# Altium project Buck.PrjPcb
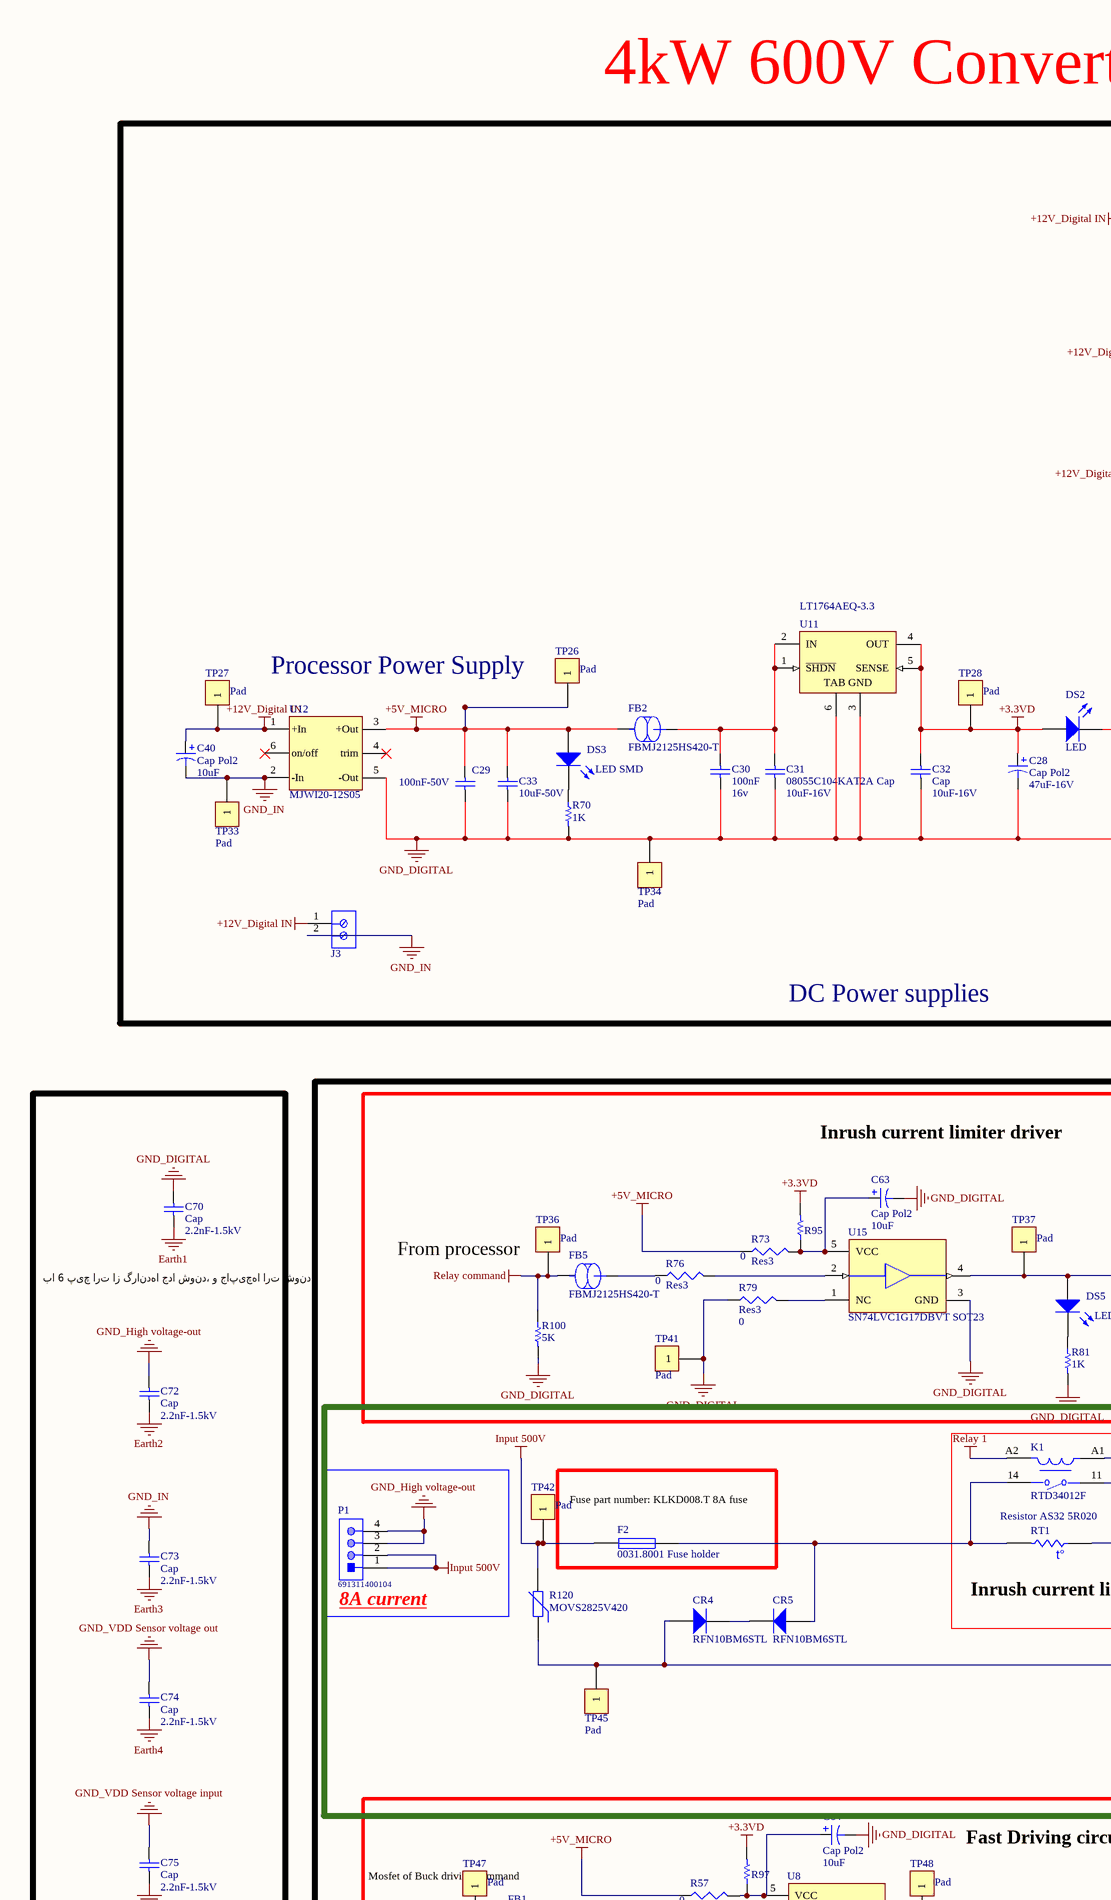
[diagram p0: Buck-15.SchDoc, top left]
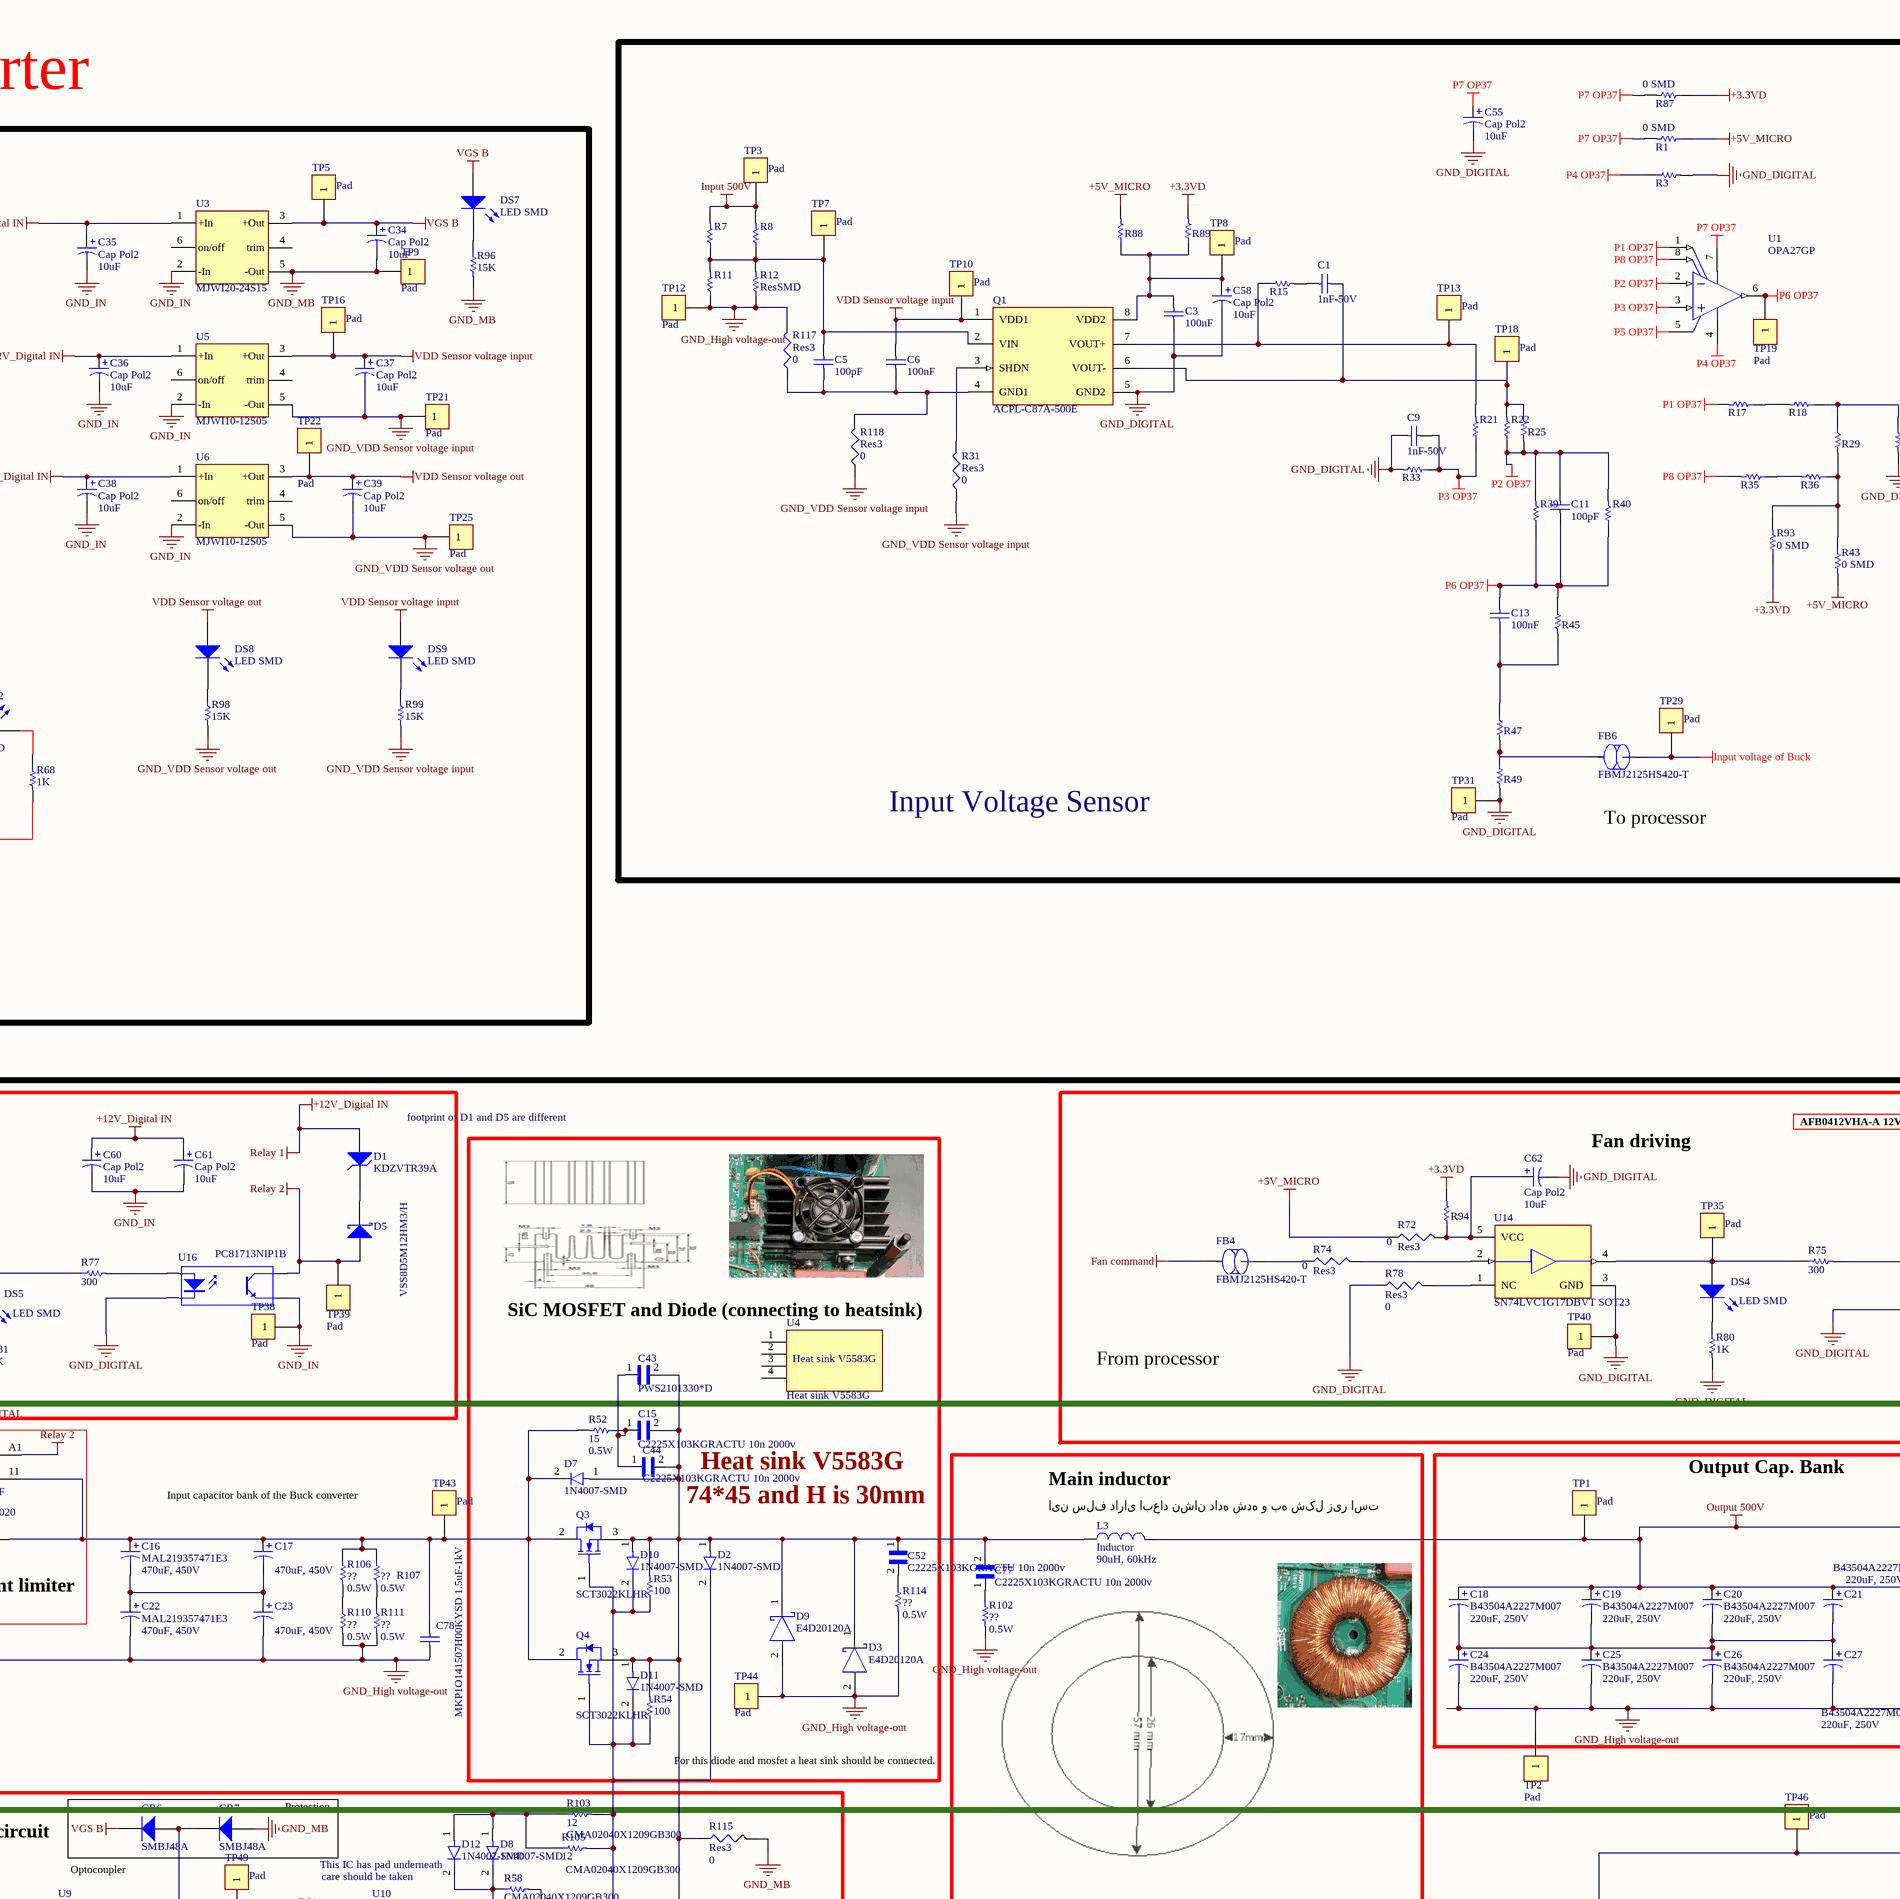
[diagram p1: Buck-15.SchDoc, top middle]
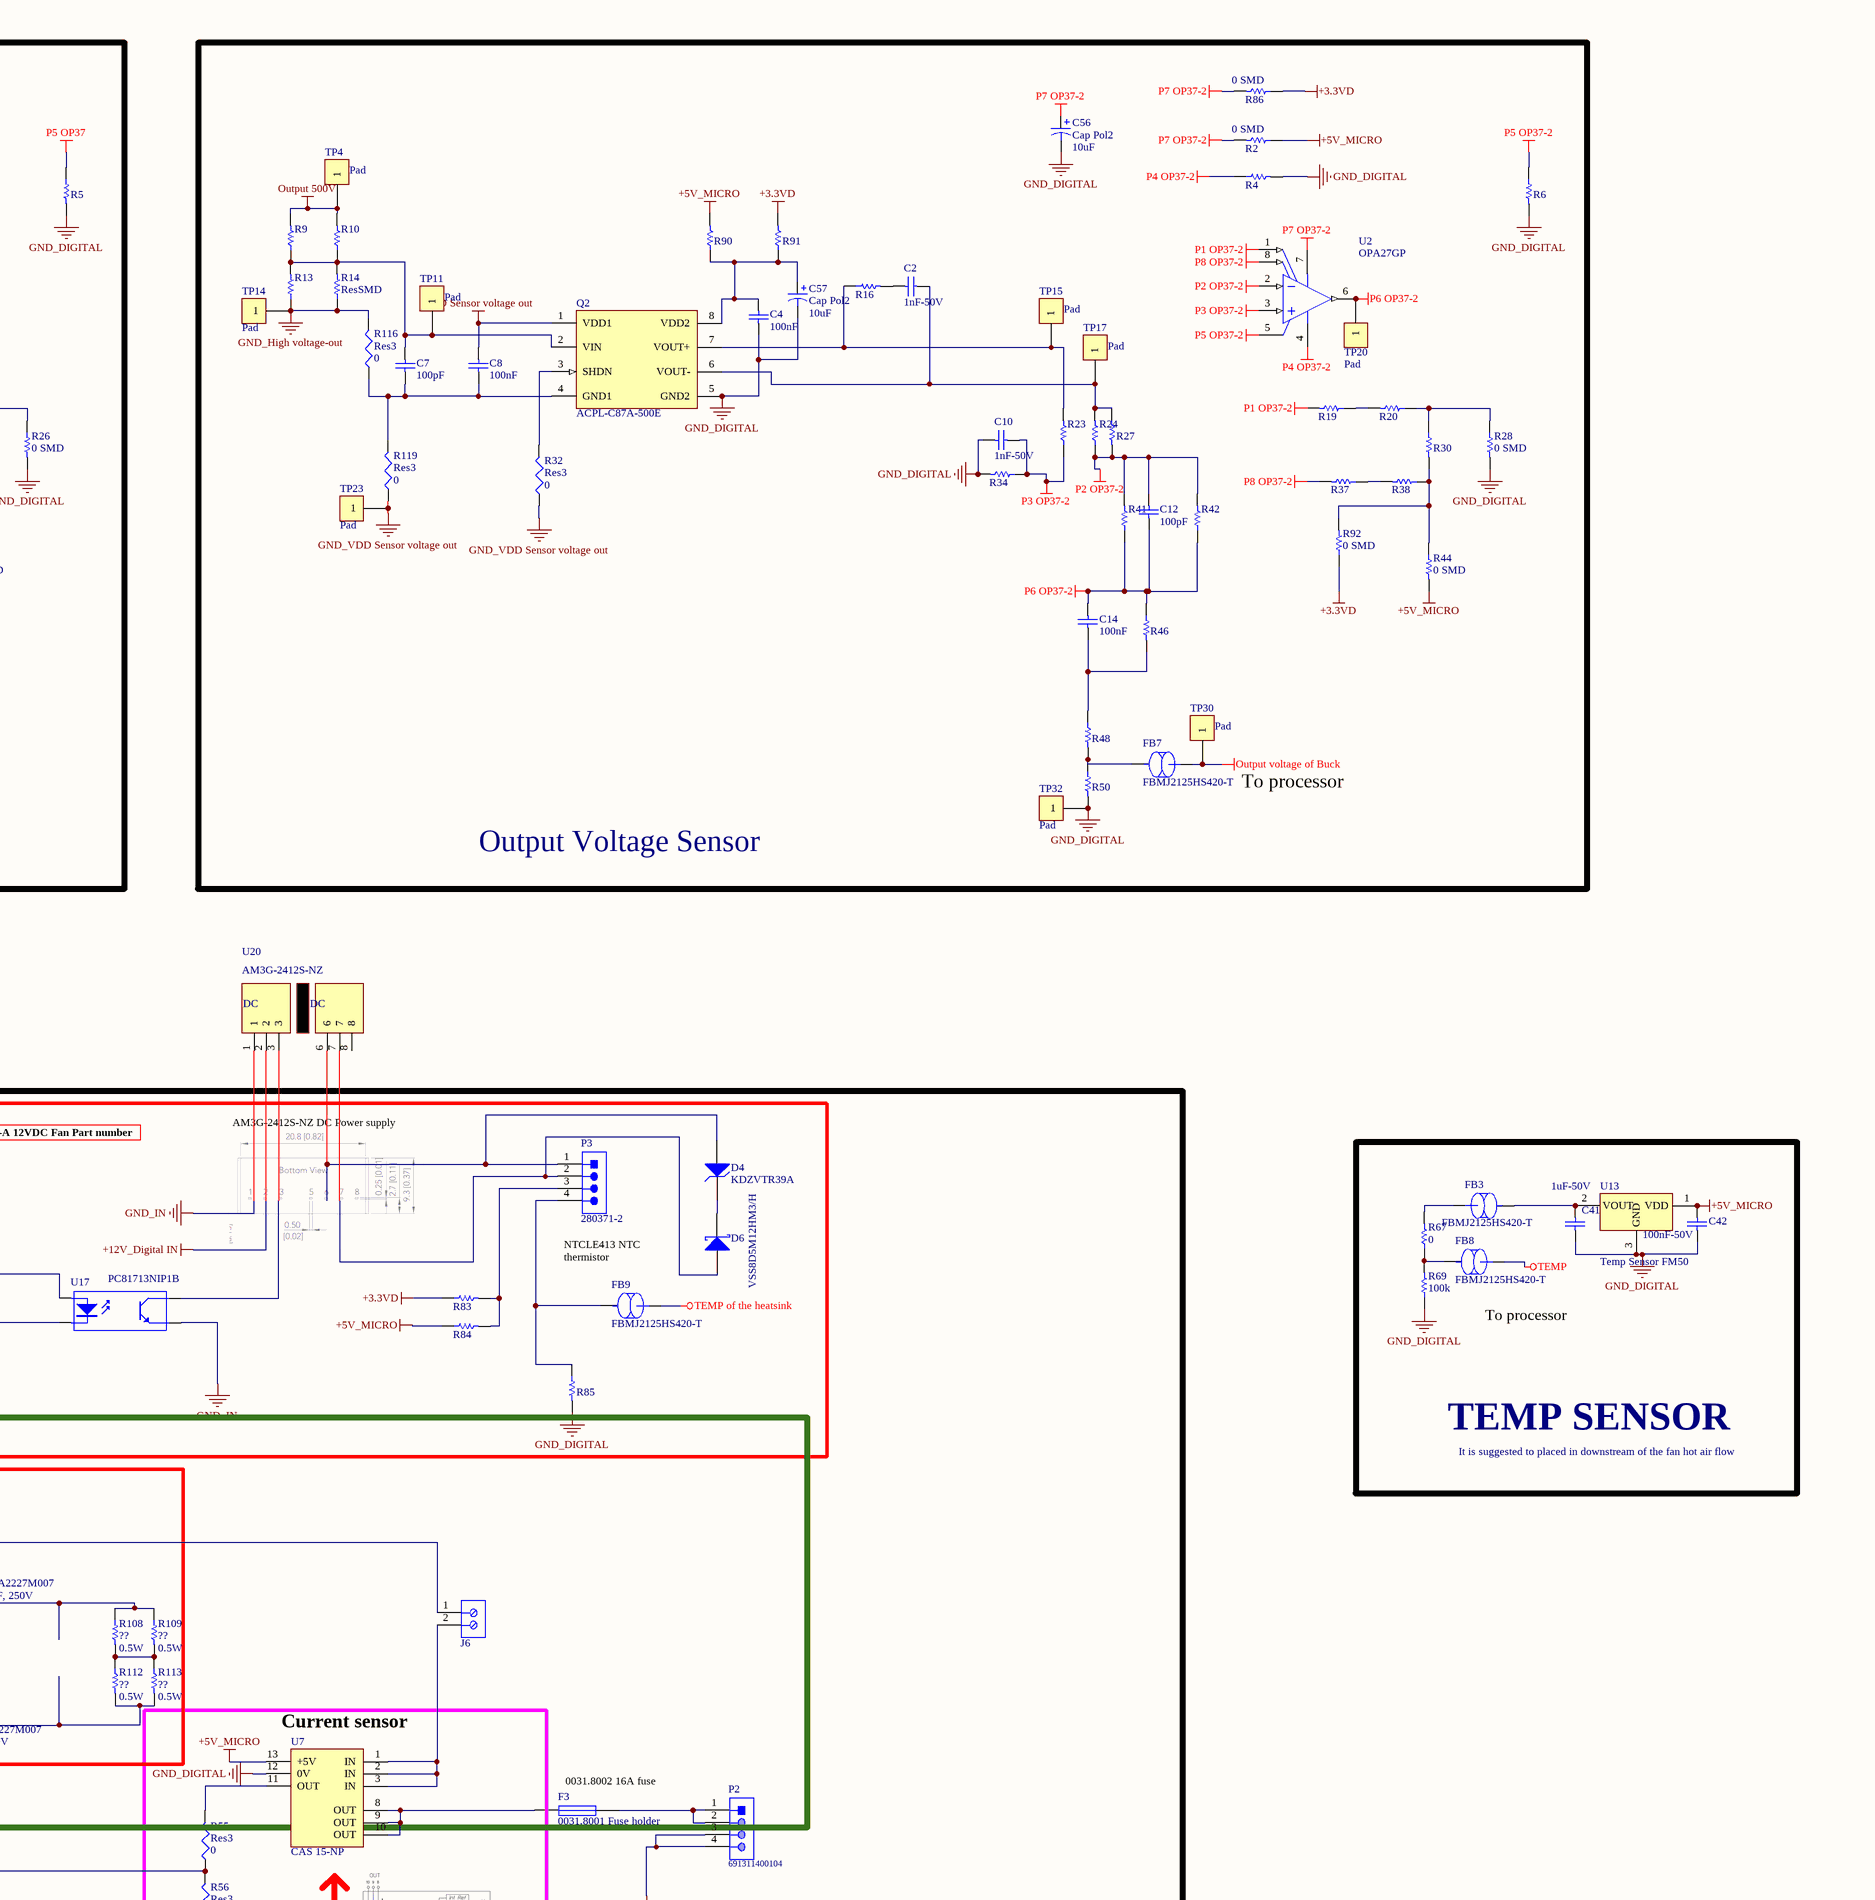
[diagram p2: Buck-15.SchDoc, top right]
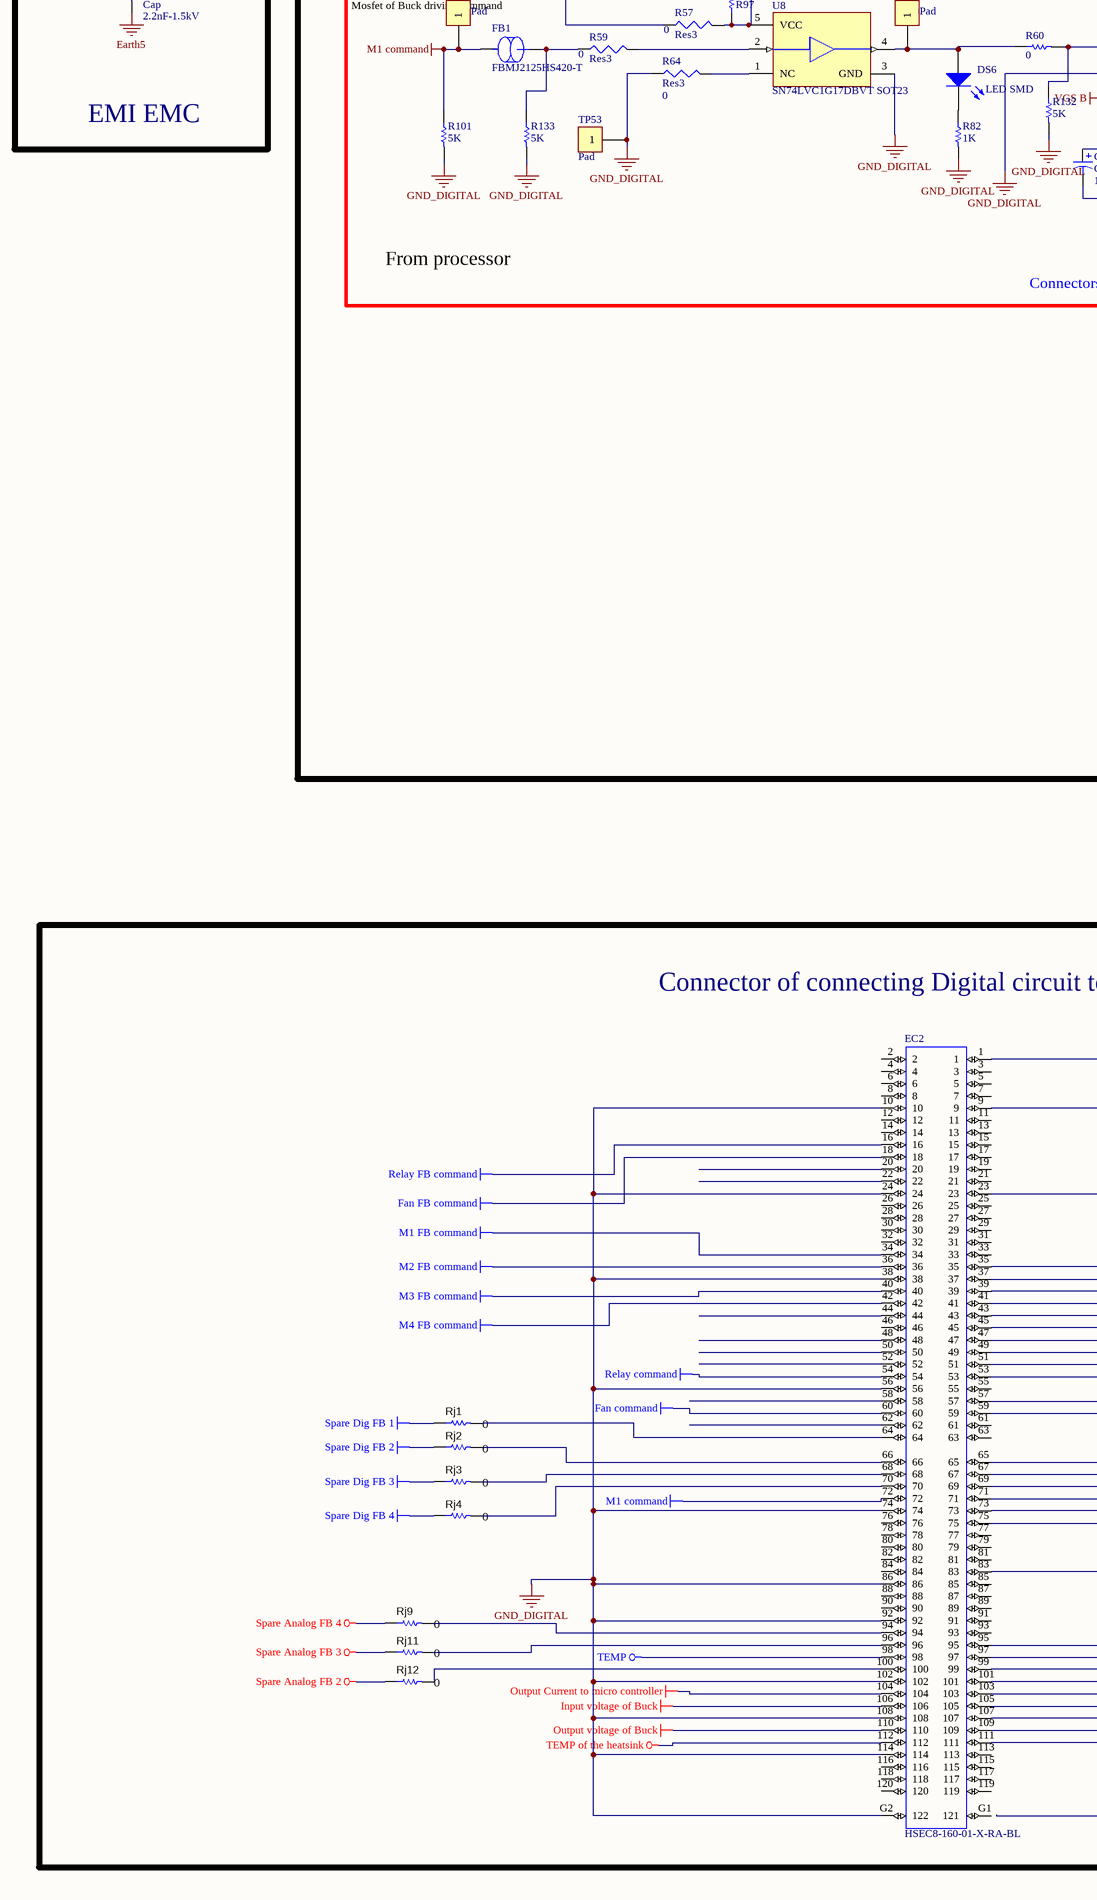
[diagram p3: Buck-15.SchDoc, bottom left]
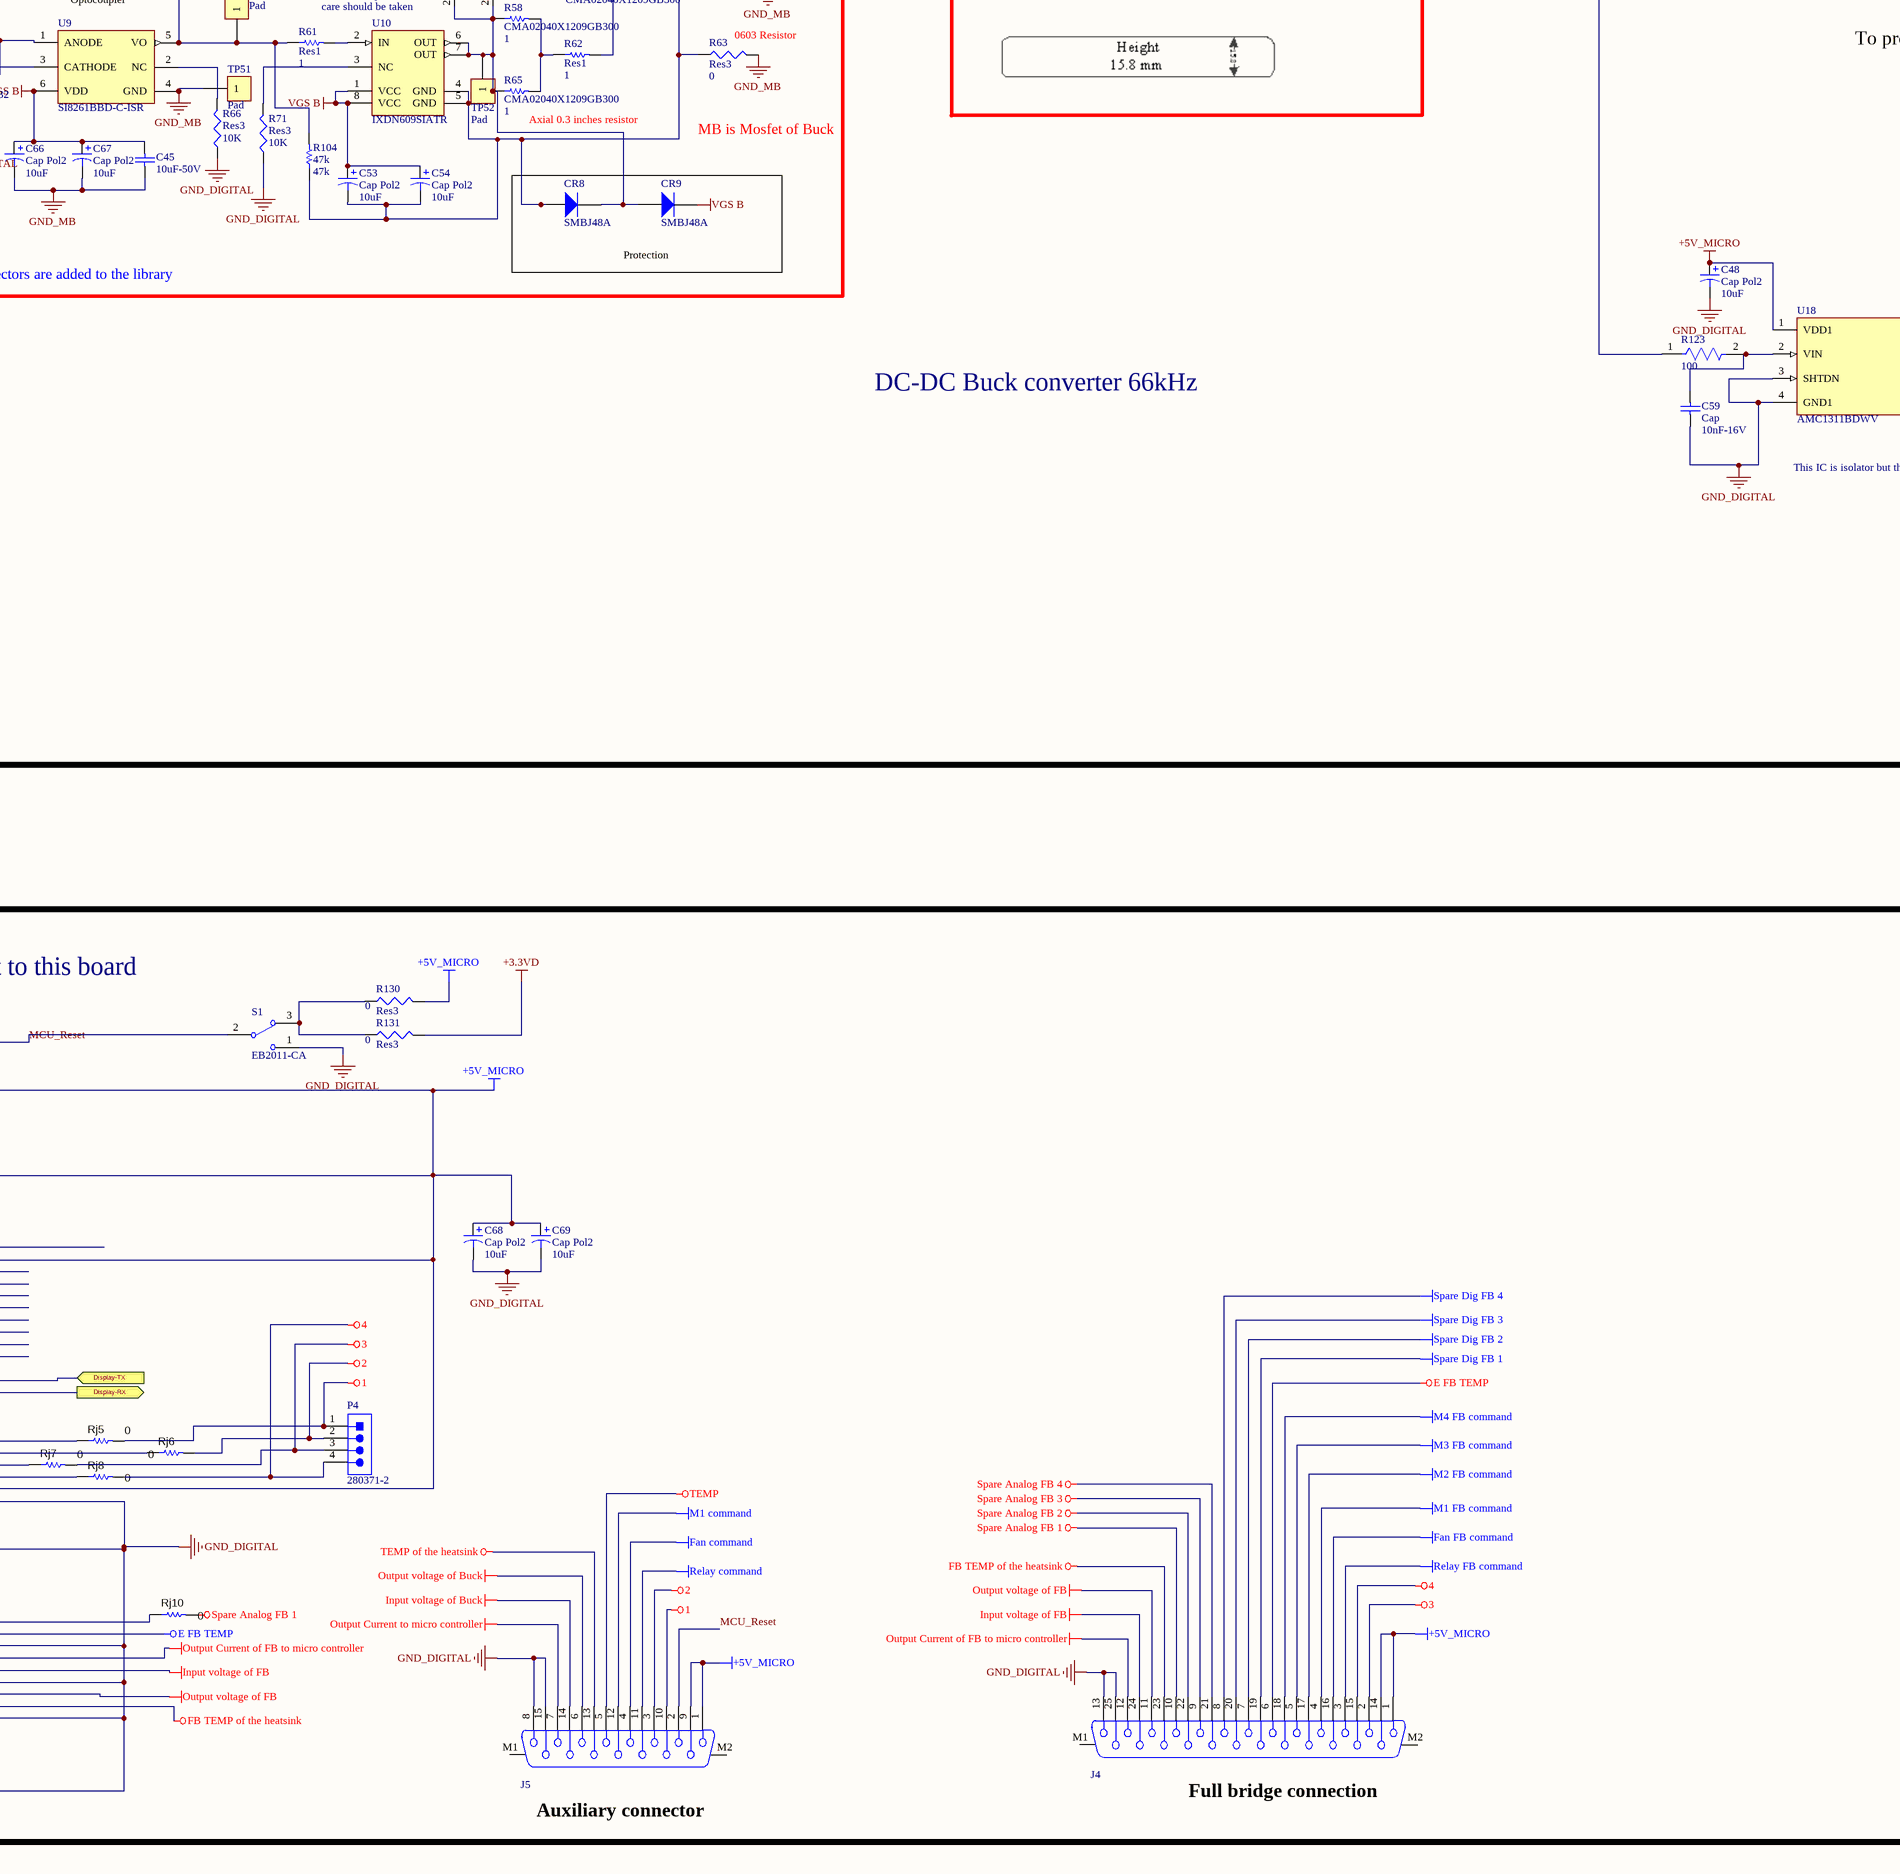
[diagram p4: Buck-15.SchDoc, bottom middle]
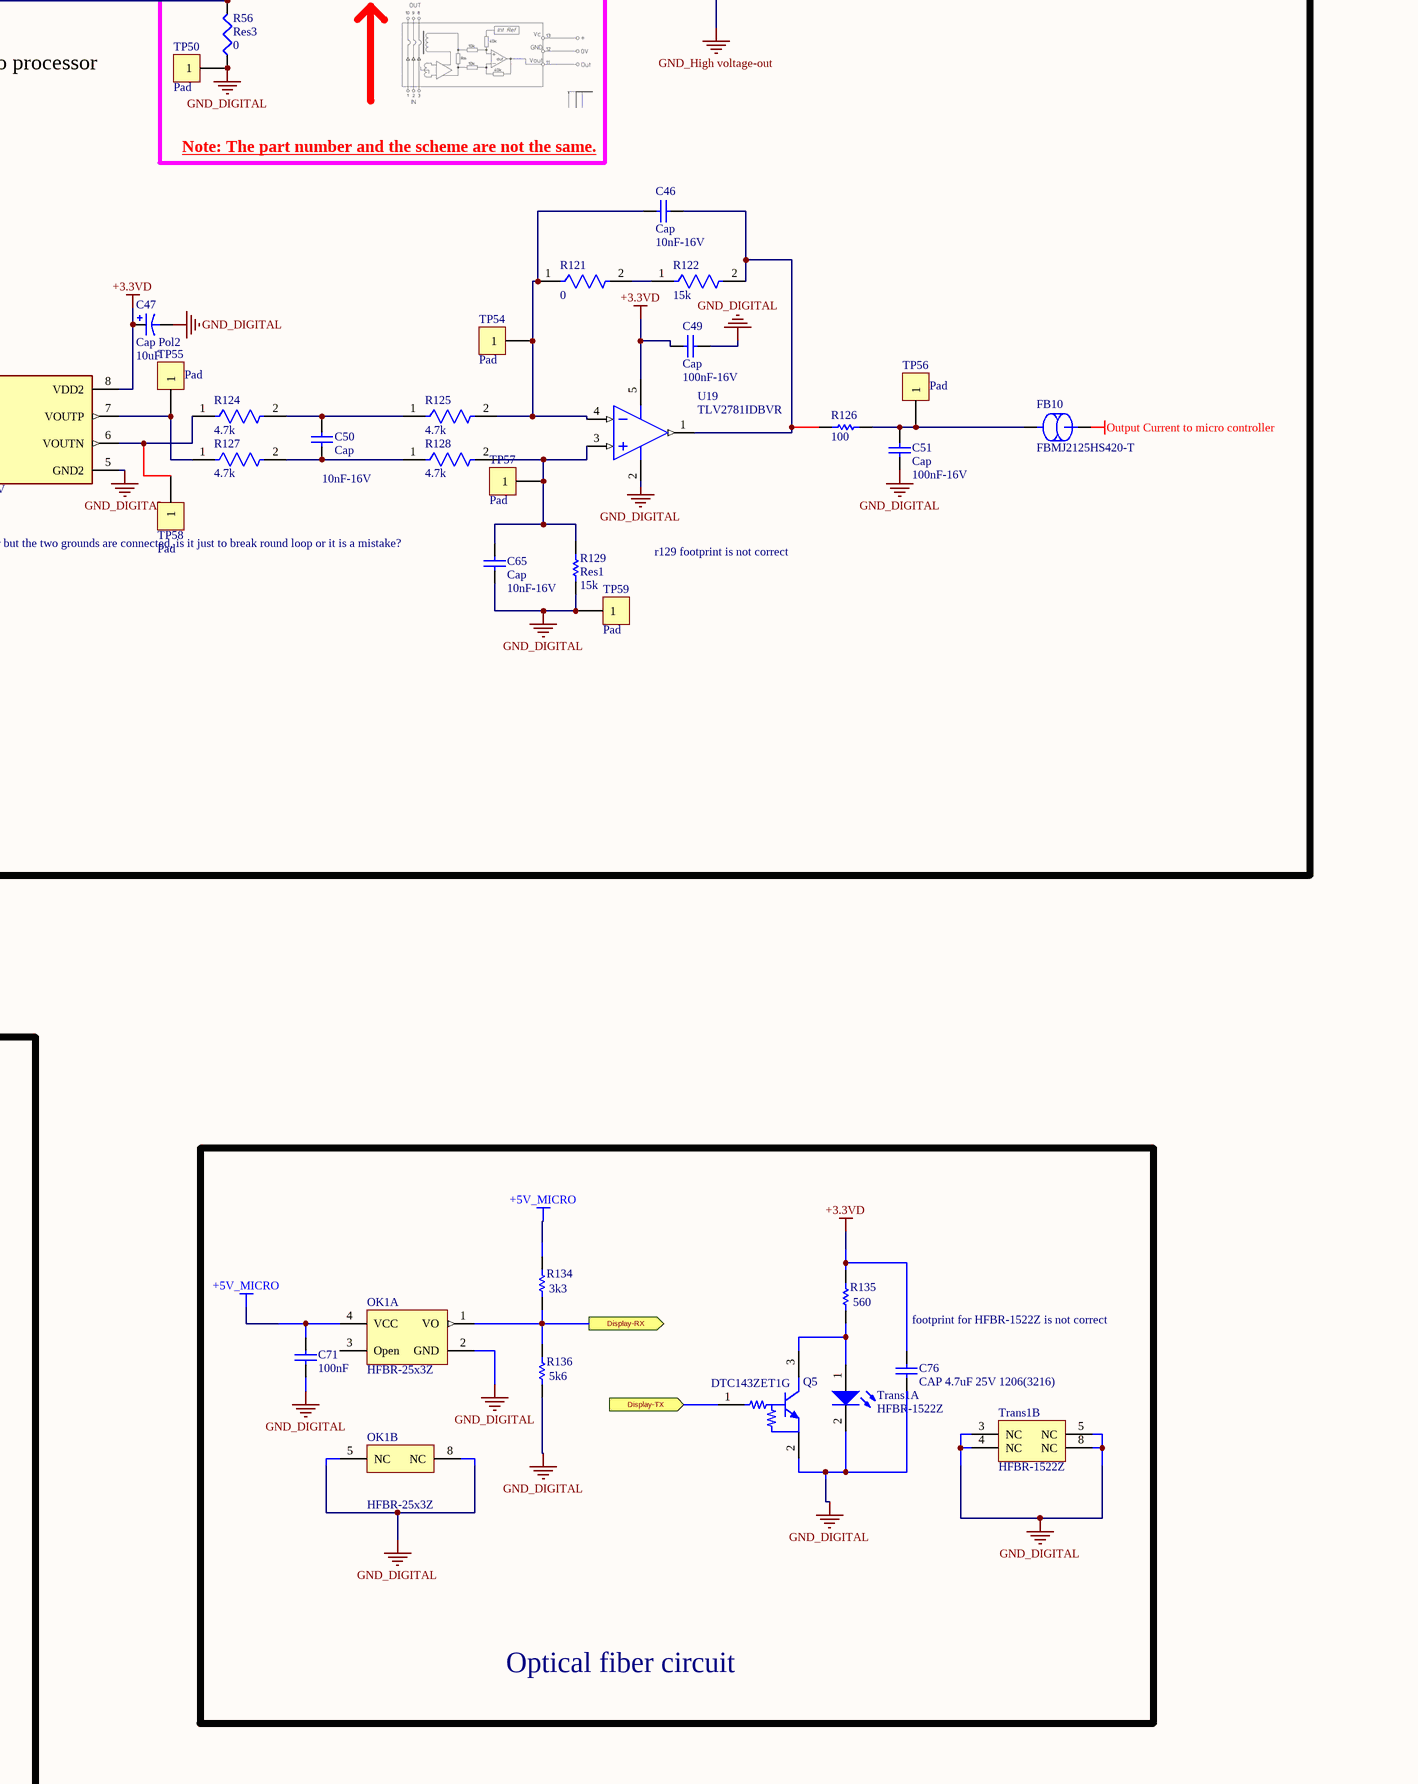
[diagram p5: Buck-15.SchDoc, bottom right]
1 sheet, 360 parts. Net scope: flat (ports and power ports of the same name join across sheets).
Board file: Buck-V1.0.PcbDoc

## Sheet Buck-15.SchDoc
size A0; SheetNumber: 1; SheetTotal: 1

### Parts
C1  1nF-50V  [C0805]
C2  1nF-50V  [C0805]
C3  100nF  [C0805]
C4  100nF  [C0805]
C5  100pF  [C0805]
C6  100nF  [C0805]
C7  100pF  [C0805]
C8  100nF  [C0805]
C9  1nF-50V  [C0805]
C10  1nF-50V  [C0805]
C11  100pF  [C0805]
C12  100pF  [C0805]
C13  100nF  [C0805]
C14  100nF  [C0805]
C15  C2225X103KGRACTU 10n 2000v  [C2225]
C16  MAL219357471E3  value 470uF, 450V  [RB-193 PUR-SI-35x50]
C17  value 470uF, 450V  [RB-193 PUR-SI-35x50]  (hidden comment: MAL219357471E3)
C18  B43504A2227M007  value 220uF, 250V  [RB-B43504]
C19  B43504A2227M007  value 220uF, 250V  [RB-B43504]
C20  B43504A2227M007  value 220uF, 250V  [RB-B43504]
C21  B43504A2227M007  value 220uF, 250V  [RB-B43504]
C22  MAL219357471E3  value 470uF, 450V  [RB-193 PUR-SI-35x50]
C23  value 470uF, 450V  [RB-193 PUR-SI-35x50]  (hidden comment: MAL219357471E3)
C24  B43504A2227M007  value 220uF, 250V  [RB-B43504]
C25  B43504A2227M007  value 220uF, 250V  [RB-B43504]
C26  B43504A2227M007  value 220uF, 250V  [RB-B43504]
C27  B43504A2227M007  value 220uF, 250V  [RB-B43504]
C28  Cap Pol2  value 47uF-16V  [CAP_Aluminum-G6.3]
C29  100nF-50V  [C0805]
C30  Volte: 16v  [C0805]  (hidden comment: 100nF)
C31  08055C104KAT2A Cap  value 10uF-16V  [C0805]
C32  Cap  value 10uF-16V  [C0805]
C33  10uF-50V  [C0805]
C34  Cap Pol2  value 10uF  [CAP_Aluminum-G6.3]
C35  Cap Pol2  value 10uF  [CAP_Aluminum-G6.3]
C36  Cap Pol2  value 10uF  [CAP_Aluminum-G6.3]
C37  Cap Pol2  value 10uF  [CAP_Aluminum-G6.3]
C38  Cap Pol2  value 10uF  [CAP_Aluminum-G6.3]
C39  Cap Pol2  value 10uF  [CAP_Aluminum-G6.3]
C40  Cap Pol2  value 10uF  [CAP_Aluminum-G6.3]
C41  1uF-50V  [C0805]
C42  100nF-50V  [C0805]
C43  PWS2101330*D  [AXIAL0.9]
C44  C2225X103KGRACTU 10n 2000v  [C2225]
C45  10uF-50V  [C0805]
C46  Cap  value 10nF-16V  [C0805]
C47  Cap Pol2  value 10uF  [CAP_Aluminum-G6.3]
C48  Cap Pol2  value 10uF  [CAP_Aluminum-G6.3]
C49  Cap  value 100nF-16V  [C0805]
C50  Cap  value 10nF-16V  [C0805]
C51  Cap  value 100nF-16V  [C0805]
C52  C2225X103KGRACTU 10n 2000v  [C2225]
C53  Cap Pol2  value 10uF  [CAP_Aluminum-G6.3]
C54  Cap Pol2  value 10uF  [CAP_Aluminum-G6.3]
C55  Cap Pol2  value 10uF  [CAP_Aluminum-G6.3]
C56  Cap Pol2  value 10uF  [CAP_Aluminum-G6.3]
C57  Cap Pol2  value 10uF  [CAP_Aluminum-G6.3]
C58  Cap Pol2  value 10uF  [CAP_Aluminum-G6.3]
C59  Cap  value 10nF-16V  [C0805]
C60  Cap Pol2  value 10uF  [CAP_Aluminum-G6.3]
C61  Cap Pol2  value 10uF  [CAP_Aluminum-G6.3]
C62  Cap Pol2  value 10uF  [CAP_Aluminum-G6.3]
C63  Cap Pol2  value 10uF  [CAP_Aluminum-G6.3]
C64  Cap Pol2  value 10uF  [CAP_Aluminum-G6.3]
C65  Cap  value 10nF-16V  [C0805]
C66  Cap Pol2  value 10uF  [CAP_Aluminum-G6.3]
C67  Cap Pol2  value 10uF  [CAP_Aluminum-G6.3]
C68  Cap Pol2  value 10uF  [CAP_Aluminum-G6.3]
C69  Cap Pol2  value 10uF  [CAP_Aluminum-G6.3]
C70  Cap  AY1222M47Y5UC63L0: 2.2nF-1.5kV  [RAD_13X4X9_P10]
C71  100nF  [C0805]
C72  Cap  AY1222M47Y5UC63L0: 2.2nF-1.5kV  [RAD_13X4X9_P10]
C73  Cap  AY1222M47Y5UC63L0: 2.2nF-1.5kV  [RAD_13X4X9_P10]
C74  Cap  AY1222M47Y5UC63L0: 2.2nF-1.5kV  [RAD_13X4X9_P10]
C75  Cap  AY1222M47Y5UC63L0: 2.2nF-1.5kV  [RAD_13X4X9_P10]
C76  CAP 4.7uF 25V 1206(3216)  [C1206]
C77  C2225X103KGRACTU 10n 2000v  [C2225]
C78  MKP1O141507H00KYSD 1.5uF-1kV  [RAD_41.5X24X45.5_P37.5]
CR4  RFN10BM6STL  [RFN10BM]
CR5  RFN10BM6STL  [RFN10BM]
CR6  SMBJ48A  [SMB (DO-214AA)]
CR7  SMBJ48A  [SMB (DO-214AA)]
CR8  SMBJ48A  [SMB (DO-214AA)]
CR9  SMBJ48A  [SMB (DO-214AA)]
D1  KDZVTR39A  [SOD-123FL]
D2  1N4007-SMD  [SMA (DO-214AC)]
D3  E4D20120A  [FP-TO-220-2-MFG]
D4  KDZVTR39A  [SOD-123FL]
D5  VSS8D5M12HM3/H  [DO-221AD]
D6  VSS8D5M12HM3/H  [DO-221AD]
D7  1N4007-SMD  [SMA (DO-214AC)]
D8  1N4007-SMD  [SMA (DO-214AC)]
D9  E4D20120A  [FP-TO-220-2-MFG]
D10  1N4007-SMD  [SMA (DO-214AC)]
D11  1N4007-SMD  [SMA (DO-214AC)]
D12  1N4007-SMD  [SMA (DO-214AC)]
DS2  LED  [LED0805]
DS3  LED SMD  [LED0805]
DS4  LED SMD  [LED0805]
DS5  LED SMD  [LED0805]
DS6  LED SMD  [LED0805]
DS7  LED SMD  [LED0805]
DS8  LED SMD  [LED0805]
DS9  LED SMD  [LED0805]
EC2  HSEC8-160-01-X-RA-BL  [HSEC816001LRA]
F2  0031.8001 Fuse holder  [00318001]
F3  0031.8001 Fuse holder  [00318001]
FB1  FBMJ2125HS420-T  [L0805]
FB2  FBMJ2125HS420-T  [L0805]
FB3  FBMJ2125HS420-T  [L0805]
FB4  FBMJ2125HS420-T  [L0805]
FB5  FBMJ2125HS420-T  [L0805]
FB6  FBMJ2125HS420-T  [L0805]
FB7  FBMJ2125HS420-T  [L0805]
FB8  FBMJ2125HS420-T  [L0805]
FB9  FBMJ2125HS420-T  [L0805]
FB10  FBMJ2125HS420-T  [L0805]
J3  691101710002  [691101710002]  (value not drawn)
J4  61802525123  [61802525123]  (value not drawn)
J5  61801525123  [61801525123]  (value not drawn)
J6  691101710002  [691101710002]  (value not drawn)
K1  RTD34012F  [FP-RTD34012F-MFG]
L3  Inductor  value 90uH, 60kHz  [Buck_Inductor_L3]
OK1  HFBR-25x3Z  [HFBR-2533Z]  (parts A,B of 2)
P1  691311400104  [691311400104]
P2  691311400104  [691311400104]
P3  280371-2  [TECO-280371-2_V]
P4  280371-2  [TECO-280371-2_V]
Q1  ACPL-C87A-500E  [FP-SSO-8-MFG]
Q2  ACPL-C87A-500E  [FP-SSO-8-MFG]
Q3  SCT3022KLHR  [INF-PG-TO247-3-44]
Q4  SCT3022KLHR  [INF-PG-TO247-3-44]
Q5  DTC143ZET1G  [ONSC-SC-75-3-463-01_V]
R1  0 SMD  [R0805]
R2  0 SMD  [R0805]
R3  ResSMD  [R0805]  (value not drawn)
R4  ResSMD  [R0805]  (value not drawn)
R5  ResSMD  [R0805]  (value not drawn)
R6  ResSMD  [R0805]  (value not drawn)
R7  ResSMD  [R0805]  (value not drawn)
R8  ResSMD  [R0805]  (value not drawn)
R9  ResSMD  [R0805]  (value not drawn)
R10  ResSMD  [R0805]  (value not drawn)
R11  ResSMD  [R0805]  (value not drawn)
R12  ResSMD  [R0805]
R13  ResSMD  [R0805]  (value not drawn)
R14  ResSMD  [R0805]
R15  ResSMD  [R0805]  (value not drawn)
R16  ResSMD  [R0805]  (value not drawn)
R17  ResSMD  [R0805]  (value not drawn)
R18  ResSMD  [R0805]  (value not drawn)
R19  ResSMD  [R0805]  (value not drawn)
R20  ResSMD  [R0805]  (value not drawn)
R21  ResSMD  [R0805]  (value not drawn)
R22  ResSMD  [R0805]  (value not drawn)
R23  ResSMD  [R0805]  (value not drawn)
R24  ResSMD  [R0805]  (value not drawn)
R25  ResSMD  [R0805]  (value not drawn)
R26  0 SMD  [R0805]
R27  ResSMD  [R0805]  (value not drawn)
R28  0 SMD  [R0805]
R29  ResSMD  [R0805]  (value not drawn)
R30  ResSMD  [R0805]  (value not drawn)
R31  Res3  value 0  [R0603]
R32  Res3  value 0  [R0603]
R33  ResSMD  [R0805]  (value not drawn)
R34  ResSMD  [R0805]  (value not drawn)
R35  ResSMD  [R0805]  (value not drawn)
R36  ResSMD  [R0805]  (value not drawn)
R37  ResSMD  [R0805]  (value not drawn)
R38  ResSMD  [R0805]  (value not drawn)
R39  ResSMD  [R0805]  (value not drawn)
R40  ResSMD  [R0805]  (value not drawn)
R41  ResSMD  [R0805]  (value not drawn)
R42  ResSMD  [R0805]  (value not drawn)
R43  0 SMD  [R0805]
R44  0 SMD  [R0805]
R45  ResSMD  [R0805]  (value not drawn)
R46  ResSMD  [R0805]  (value not drawn)
R47  ResSMD  [R0805]  (value not drawn)
R48  ResSMD  [R0805]  (value not drawn)
R49  ResSMD  [R0805]  (value not drawn)
R50  ResSMD  [R0805]  (value not drawn)
R52  15  value 0.5W  [AXIAL-0.5]
R53  100  [R0805]
R54  100  [R0805]
R55  Res3  value 0  [R0603]
R56  Res3  value 0  [R0603]
R57  Res3  value 0  [R0603]
R58  CMA02040X1209GB300  value 1  [MMF50S]
R59  Res3  value 0  [R0603]
R60  0  [R0805]
R61  Res1  value 1  [R0805]
R62  Res1  value 1  [R0805]
R63  Res3  value 0  [R0603]
R64  Res3  value 0  [R0603]
R65  CMA02040X1209GB300  value 1  [MMF50S]
R66  Res3  value 10K  [R0603]
R67  0  [R0805]
R68  1K  [R0805]
R69  100k  [R0805]
R70  1K  [R0805]
R71  Res3  value 10K  [R0603]
R72  Res3  value 0  [R0603]
R73  Res3  value 0  [R0603]
R74  Res3  value 0  [R0603]
R75  300  [R0805]
R76  Res3  value 0  [R0603]
R77  300  [R0805]
R78  Res3  value 0  [R0603]
R79  Res3  value 0  [R0603]
R80  1K  [R0805]
R81  1K  [R0805]
R82  1K  [R0805]
R83  ResSMD  [R0805]  (value not drawn)
R84  ResSMD  [R0805]  (value not drawn)
R85  ResSMD  [R0805]  (value not drawn)
R86  0 SMD  [R0805]
R87  0 SMD  [R0805]
R88  ResSMD  [R0805]  (value not drawn)
R89  ResSMD  [R0805]  (value not drawn)
R90  ResSMD  [R0805]  (value not drawn)
R91  ResSMD  [R0805]  (value not drawn)
R92  0 SMD  [R0805]
R93  0 SMD  [R0805]
R94  ResSMD  [R0805]  (value not drawn)
R95  ResSMD  [R0805]  (value not drawn)
R96  15K  [R0805]
R97  ResSMD  [R0805]  (value not drawn)
R98  15K  [R0805]
R99  15K  [R0805]
R100  5K  [R0805]
R101  5K  [R0805]
R102  ??  value 0.5W  [AXIAL-0.5]
R103  12  value CMA02040X1209GB300  [R0805]
R104  47k  [R0805]
R105  12  value CMA02040X1209GB300  [R0805]
R106  ??  value 0.5W  [AXIAL-0.5]
R107  ??  value 0.5W  [AXIAL-0.5]
R108  ??  value 0.5W  [AXIAL-0.5]
R109  ??  value 0.5W  [AXIAL-0.5]
R110  ??  value 0.5W  [AXIAL-0.5]
R111  ??  value 0.5W  [AXIAL-0.5]
R112  ??  value 0.5W  [AXIAL-0.5]
R113  ??  value 0.5W  [AXIAL-0.5]
R114  ??  value 0.5W  [AXIAL-0.5]
R115  Res3  value 0  [R0603]
R116  Res3  value 0  [R0603]
R117  Res3  value 0  [R0603]
R118  Res3  value 0  [R0603]
R119  Res3  value 0  [R0603]
R120  MOVS2825V420  [MOVS2825V420]
R121  0  [R0805]
R122  15k  [R0805]
R123  100  [R0805]
R124  4.7k  [R0805]
R125  4.7k  [R0805]
R126  100  [R0805]
R127  4.7k  [R0805]
R128  4.7k  [R0805]
R129  Res1  value 15k  [R0805]
R130  Res3  value 0  [R0603]
R131  Res3  value 0  [R0603]
R132  5K  [R0805]
R133  5K  [R0805]
R134  Resistance: 3k3  [R0805]  (hidden comment: RC0603JR-13820RL)
R135  Resistance: 560  [R0805]  (hidden comment: RC0603JR-13820RL)
R136  Resistance: 5k6  [R0805]  (hidden comment: RC0603JR-13820RL)
Rj1  ValueDisplayed: 0  [R0603]  (hidden comment: ERJ-3GEY0R00V)
Rj2  ValueDisplayed: 0  [R0603]  (hidden comment: ERJ-3GEY0R00V)
Rj3  ValueDisplayed: 0  [R0603]  (hidden comment: ERJ-3GEY0R00V)
Rj4  ValueDisplayed: 0  [R0603]  (hidden comment: ERJ-3GEY0R00V)
Rj5  ValueDisplayed: 0  [R0603]  (hidden comment: ERJ-3GEY0R00V)
Rj6  ValueDisplayed: 0  [R0603]  (hidden comment: ERJ-3GEY0R00V)
Rj7  ValueDisplayed: 0  [R0603]  (hidden comment: ERJ-3GEY0R00V)
Rj8  ValueDisplayed: 0  [R0603]  (hidden comment: ERJ-3GEY0R00V)
Rj9  ValueDisplayed: 0  [R0603]  (hidden comment: ERJ-3GEY0R00V)
Rj10  ValueDisplayed: 0  [R0603]  (hidden comment: ERJ-3GEY0R00V)
Rj11  ValueDisplayed: 0  [R0603]  (hidden comment: ERJ-3GEY0R00V)
Rj12  ValueDisplayed: 0  [R0603]  (hidden comment: ERJ-3GEY0R00V)
RT1  Resistor AS32 5R020  [AS32 5R020]
S1  EB2011-CA  [EB2011-CA]
TP1  Pad  [TP-0.5mm]
TP2  Pad  [TP-0.5mm]
TP3  Pad  [TP-0.5mm]
TP4  Pad  [TP-0.5mm]
TP5  Pad  [TP-0.5mm]
TP7  Pad  [TP-0.5mm]
TP8  Pad  [TP-0.5mm]
TP9  Pad  [TP-0.5mm]
TP10  Pad  [TP-0.5mm]
TP11  Pad  [TP-0.5mm]
TP12  Pad  [TP-0.5mm]
TP13  Pad  [TP-0.5mm]
TP14  Pad  [TP-0.5mm]
TP15  Pad  [TP-0.5mm]
TP16  Pad  [TP-0.5mm]
TP17  Pad  [TP-0.5mm]
TP18  Pad  [TP-0.5mm]
TP19  Pad  [TP-0.5mm]
TP20  Pad  [TP-0.5mm]
TP21  Pad  [TP-0.5mm]
TP22  Pad  [TP-0.5mm]
TP23  Pad  [TP-0.5mm]
TP25  Pad  [TP-0.5mm]
TP26  Pad  [TP-0.5mm]
TP27  Pad  [TP-0.5mm]
TP28  Pad  [TP-0.5mm]
TP29  Pad  [TP-0.5mm]
TP30  Pad  [TP-0.5mm]
TP31  Pad  [TP-0.5mm]
TP32  Pad  [TP-0.5mm]
TP33  Pad  [TP-0.5mm]
TP34  Pad  [TP-0.5mm]
TP35  Pad  [TP-0.5mm]
TP36  Pad  [TP-0.5mm]
TP37  Pad  [TP-0.5mm]
TP38  Pad  [TP-0.5mm]
TP39  Pad  [TP-0.5mm]
TP40  Pad  [TP-0.5mm]
TP41  Pad  [TP-0.5mm]
TP42  Pad  [TP-0.5mm]
TP43  Pad  [TP-0.5mm]
TP44  Pad  [TP-0.5mm]
TP45  Pad  [TP-0.5mm]
TP46  Pad  [TP-0.5mm]
TP47  Pad  [TP-0.5mm]
TP48  Pad  [TP-0.5mm]
TP49  Pad  [TP-0.5mm]
TP50  Pad  [TP-0.5mm]
TP51  Pad  [TP-0.5mm]
TP52  Pad  [TP-0.5mm]
TP53  Pad  [TP-0.5mm]
TP54  Pad  [TP-0.5mm]
TP55  Pad  [TP-0.5mm]
TP56  Pad  [TP-0.5mm]
TP57  Pad  [TP-0.5mm]
TP58  Pad  [TP-0.5mm]
TP59  Pad  [TP-0.5mm]
Trans1  HFBR-1522Z  [HFBR-1522Z]  (parts A,B of 2)
U1  OPA27GP  [P0008A]
U2  OPA27GP  [P0008A]
U3  MJWI20-24S15  [MJWI15-24S15]
U4  Heat sink V5583G  [Buck_heatsink]
U5  MJWI10-12S05  [MJWI15-24S05]
U6  MJWI10-12S05  [MJWI15-24S05]
U7  CAS 15-NP  [CAS 15-NP]
U8  SN74LVC1G17DBVT SOT23  [SOT95P280X145-5N]
U9  SI8261BBD-C-ISR  [SLAB-SDIP6_N]
U10  IXDN609SIATR  [IXDN609SIATR]
U11  LT1764AEQ-3.3  [LT1764AEQ33TRPBF]
U12  MJWI20-12S05  [MJWI15-24S05]
U13  Temp Sensor FM50  [SOT-23]
U14  SN74LVC1G17DBVT SOT23  [SOT95P280X145-5N]
U15  SN74LVC1G17DBVT SOT23  [SOT95P280X145-5N]
U16  PC81713NIP1B  [SOP-4L]
U17  PC81713NIP1B  [SOP-4L]
U18  AMC1311BDWV  [FP-DWV0008A-MFG]
U19  TLV2781IDBVR  [DBV0005A_L]
U20  AM3G-2412S-NZ  [AM3G-2412S-NZ]

### Blocks framed on the sheet
Input Voltage Sensor: C1 C3 C5 C6 C9 C11 C13 C55 C58 FB6 Q1 R1 R3 R5 R7 R8 R11 R12 R15 R17 R18 R21 R22 R25 R26 R29 R31 R33 R35 R36 R39 R40 R43 R45 R47 R49 R87-R89 R93 R117 R118 TP3 TP7 TP8 TP10 TP12 TP13 TP18 TP19 TP29 TP31 U1
Output Voltage Sensor: C2 C4 C7 C8 C10 C12 C14 C56 C57 FB7 Q2 R2 R4 R6 R9 R10 R13 R14 R16 R19 R20 R23 R24 R27 R28 R30 R32 R34 R37 R38 R41 R42 R44 R46 R48 R50 R86 R90-R92 R116 R119 TP4 TP11 TP14 TP15 TP17 TP20 TP23 TP30 TP32 U2
EMI EMC: C70 C72-C75
TEMP SENSOR: C41 C42 FB3 FB8 R67 R69 U13
Inrush current limiter: K1 RT1
8A current: P1
Main inductor: C77 L3 R102
Output Cap. Bank: C18-C21 C24-C27 R108 R109 R112 R113 TP1
Current sensor: R55 R56 TP50 U7
Protection: CR6 CR7
Protection: CR8 CR9
Connector of connecting Digital circuit to this board: C68 C69 EC2 J4 J5 P4 R130 R131 Rj1-Rj12 S1
Optical fiber circuit: C71 C76 OK1 Q5 R134-R136 Trans1

### Ports
Display-RX (out), Display-TX (in)

### Nets
1: J5.10 P4.1 Rj5.2
2: J5.3 P4.2 Rj6.2
3: J4.2 P4.3 Rj7.2
4: J4.15 P4.4 Rj8.2
+3.3VD: C28.1 C32.2 C47.1 C49.2 C76.2 DS2.1(A) R83.1 R86.1 R87.1 R89.2 R91.2 R92.1 R93.1 R94.2 R95.2 R97.2 R131.2 R135.1 TP28.1 U11.4(OUT) U11.5(SENSE) U18.8(VDD2) U19.5(V+)
+5V_MICRO: C29.2 C33.2 C42.2 C48.1 C68.1 C69.1 C71.1 DS3.1(A) EC2.9 EC2.23 EC2.37 EC2.73 FB2.1 J4.1 J4.14 J5.1 J5.9 OK1.4(VCC) R1.1 R2.1 R43.2 R44.2 R57.1 R72.1 R73.1 R84.1 R88.2 R90.2 R130.2 R134.1 TP26.1 U7.13(+5V) U12.3(+Out) U13.1(VDD) U18.1(VDD1)
+12V_Digital IN: C35.1 C36.1 C38.1 C40.1 C60.1 C61.1 D1.1(A) J3.1 K1.A2 TP27.1 U3.1(+In) U5.1(+In) U6.1(+In) U12.1(+In) U20.2  [also labelled Relay 1]
E FB TEMP: EC2.97 J4.6
Earth1: C70.1
Earth2: C72.1
Earth3: C73.1
Earth4: C74.1
Earth5: C75.1
Fan command: EC2.60 FB4.1 J5.4
Fan FB command: EC2.18 J4.16
FB TEMP of the heatsink: EC2.109 J4.23
GND_DIGITAL: C3.2 C4.2 C9.2 C10.2 C28.2 C29.1 C30.1 C31.1 C32.1 C33.1 C41.1 C42.1 C47.2 C48.2 C49.1 C51.1 C55.2 C56.2 C57.2 C58.2 C59.1 C62.2 C63.2 C64.2 C65.1 C68.2 C69.2 C70.2 C71.2 C76.1 EC2.10 EC2.24 EC2.38 EC2.56 EC2.74 EC2.75 EC2.83 EC2.86 EC2.92 EC2.99 EC2.102 EC2.105 EC2.108 EC2.111 EC2.114 EC2.G2(122) J4.13 J4.25 J5.8 J5.15 OK1.2(GND) OK1.5(NC) OK1.8(NC) Q1.5(GND2) Q2.5(GND2) Q5.2(E) R3.2 R4.2 R5.2 R6.2 R26.2 R28.2 R33.2 R34.2 R49.2 R50.2 R56.1 R64.1 R66.1 R68.2 R69.1 R70.2 R71.1 R78.1 R79.1 R80.2 R81.2 R82.2 R85.2 R100.2 R101.2 R129.1 R132.2 R133.2 R136.2 S1.1 TP31.1 TP32.1 TP34.1 TP40.1 TP41.1 TP50.1 TP53.1 TP59.1 Trans1.2(CATHODE) Trans1.3(NC) Trans1.4(NC) Trans1.5(NC) Trans1.8(NC) U7.12(0V) U8.3(GND) U9.3(CATHODE) U11.3(GND) U11.6(TAB) U12.5(-Out) U13.3(GND) U14.3(GND) U15.3(GND) U16.2(K) U17.2(K) U18.3(SHTDN) U18.4(GND1) U18.5(GND2) U19.2(V-)
GND_High voltage-out: C22.2 C23.2 C24.2 C25.2 C26.2 C27.2 C72.2 C78.1 CR4.1(A) D3.2(A) D9.2(A) P1.3 P1.4 P2.3 P2.4 R11.1 R12.1 R13.1 R14.1 R102.2 R110.2 R111.2 R112.2 R113.2 R114.2 R116.2 R117.2 R120.1 TP2.1 TP12.1 TP14.1 TP44.1 TP45.1
GND_IN: C35.2 C36.2 C38.2 C40.2 C60.2 C61.2 C73.2 J3.2 TP33.1 TP38.1 U3.2(-In) U5.2(-In) U6.2(-In) U12.2(-In) U16.3(E) U17.3(E) U20.1
GND_MB: C34.2 C45.1 C66.2 C67.2 CR7.1(A) R63.2 R96.2 R115.2 TP9.1 TP51.1 U3.5(-Out) U9.4(GND)
GND_VDD Sensor voltage input: C37.2 C75.2 R31.1 R99.2 R118.1 TP21.1 U5.5(-Out)
GND_VDD Sensor voltage out: C39.2 C74.2 R32.1 R98.2 R119.1 TP23.1 TP25.1 U6.5(-Out)
Input 500V: F2.1 P1.1 P1.2 R7.2 R8.2 R120.2 TP3.1 TP42.1
Input voltage of Buck: EC2.106 FB6.2 J5.14 TP29.1
Input voltage of FB: EC2.103 J4.24
M1 command: EC2.72 FB1.1 J5.12 R101.1 TP47.1
M1 FB command: EC2.34 J4.4
M2 FB command: EC2.36 J4.17
M3 FB command: EC2.40 J4.5
M4 FB command: EC2.42 J4.18
Output 500V: C18.1 C19.1 C20.1 C21.1 J6.1 L3.2 R9.2 R10.2 R108.1 R109.1 TP1.1 TP4.1
Output Current of FB to micro controller: EC2.101 J4.12
Output Current to micro controller: EC2.104 FB10.2 J5.7
Output voltage of Buck: EC2.110 FB7.2 J5.6 TP30.1
Output voltage of FB: EC2.107 J4.11
P1 OP37: R17.2 U1.1(OFFSET_TRIM)
P1 OP37-2: R19.2 U2.1(OFFSET_TRIM)
P2 OP37: C11.1 R22.1 R25.2 R39.2 R40.2 U1.2(IN-)
P2 OP37-2: C12.1 R24.1 R27.2 R41.2 R42.2 U2.2(IN-)
P3 OP37: C9.1 R21.1 R33.1 U1.3(IN+)
P3 OP37-2: C10.1 R23.1 R34.1 U2.3(IN+)
P4 OP37: R3.1 U1.4(VCC-)
P4 OP37-2: R4.1 U2.4(VCC-)
P5 OP37: R5.1 U1.5(NC)
P5 OP37-2: R6.1 U2.5(NC)
P6 OP37: C11.2 C13.1 R39.1 R40.1 R45.1 TP19.1 U1.6(OUT)
P6 OP37-2: C12.2 C14.1 R41.1 R42.1 R46.1 TP20.1 U2.6(OUT)
P7 OP37: C55.1 R1.2 R87.2 U1.7(VCC+)
P7 OP37-2: C56.1 R2.2 R86.2 U2.7(VCC+)
P8 OP37: R35.2 U1.8(OFFSET_TRIM)
P8 OP37-2: R37.2 U2.8(OFFSET_TRIM)
Relay 2: D5.1(A) K1.A1 TP39.1 U16.4(C)
Relay command: EC2.54 FB5.1 J5.11 R100.1 TP36.1
Relay FB command: EC2.16 J4.3
Spare Analog FB 1: J4.10 Rj10.2
Spare Analog FB 2: J4.22 Rj12.1
Spare Analog FB 3: J4.9 Rj11.1
Spare Analog FB 4: J4.21 Rj9.1
Spare Dig FB 1: J4.19 Rj1.1
Spare Dig FB 2: J4.7 Rj2.1
Spare Dig FB 3: J4.20 Rj3.1
Spare Dig FB 4: J4.8 Rj4.1
TEMP: EC2.98 FB8.2 J5.5
TEMP of the heatsink: EC2.112 FB9.2 J5.13
VDD Sensor voltage input: C6.1 C37.1 DS9.1(A) Q1.1(VDD1) TP10.1 TP16.1 U5.3(+Out)
VDD Sensor voltage out: C8.1 C39.1 DS8.1(A) Q2.1(VDD1) TP22.1 U6.3(+Out)
VGS B: C34.1 C45.2 C53.1 C54.1 C66.1 C67.1 CR6.2(K) CR9.2(K) DS7.1(A) TP5.1 U3.3(+Out) U9.6(VDD) U10.1(VCC) U10.8(VCC)
MCU_Reset: EC2.1 J5.2 S1.2
NetC1_1: C1.1 Q1.6(VOUT-) R22.2 R25.1 TP18.1
NetC1_2: C1.2 R15.2
NetC2_1: C2.1 Q2.6(VOUT-) R24.2 R27.1 TP17.1
NetC2_2: C2.2 R16.2
NetC3_1: C3.1 C58.1 Q1.8(VDD2) R88.1 R89.1 TP8.1
NetC4_1: C4.1 C57.1 Q2.8(VDD2) R90.1 R91.1
NetC5_1: C5.1 Q1.2(VIN) R7.1 R8.1 R11.2 R12.2 TP7.1
NetC5_2: C5.2 C6.2 Q1.4(GND1) R117.1 R118.2
NetC7_1: C7.1 Q2.2(VIN) R9.1 R10.1 R13.2 R14.2 TP11.1
NetC7_2: C7.2 C8.2 Q2.4(GND1) R116.1 R119.2
NetC13_2: C13.2 R45.2 R47.1
NetC14_2: C14.2 R46.2 R48.1
NetC15_1: C15.1 C43.1 C44.1 R52.1
NetC15_2: C15.2 C43.2 C44.2 C52.1 C53.2 C54.2 C77.2 CR8.1(A) D2.1(A) D3.1(C) D7.1(A) D9.1(C) D10.1(A) D11.1(A) L3.1 Q3.3(SOURCE) Q4.3(SOURCE) R53.2 R54.2 R63.1 R104.1 R115.1 U10.4(GND) U10.5(GND)
NetC16_1: C16.1 C17.1 C78.2 D7.2(C) K1.11 Q3.2(DRAIN) Q4.2(DRAIN) R52.2 R106.1 R107.1 RT1.1 TP43.1
NetC16_2: C16.2 C17.2 C22.1 C23.1
NetC18_2: C18.2 C19.2 C20.2 C21.2 C24.1 C25.1 C26.1 C27.1
NetC30_2: C30.2 C31.2 FB2.2 U11.1(~{SHDN}) U11.2(IN)
NetC41_2: C41.2 FB3.1 U13.2(VOUT)
NetC46_1: C46.1 R122.2 R126.1 U19.1(OUT)
NetC46_2: C46.2 R121.1 R125.2 TP54.1 U19.4(IN-)
NetC50_1: C50.1 R127.2 R128.1
NetC50_2: C50.2 R124.2 R125.1
NetC51_2: C51.2 FB10.1 R126.2 TP56.1
NetC52_2: C52.2 R114.1
NetC59_2: C59.2 R123.2 U18.2(VIN)
NetC62_1: C62.1 R72.2 R94.1 U14.5(VCC)
NetC63_1: C63.1 R73.2 R95.1 U15.5(VCC)
NetC64_1: C64.1 R57.2 R97.1 U8.5(VCC)
NetC65_2: C65.2 R128.2 R129.2 TP57.1 U19.3(IN+)
NetC77_1: C77.1 R102.1
NetCR4_2: CR4.2(K) CR5.2(K)
NetCR5_1: CR5.1(A) F2.2 K1.14 RT1.2
NetCR6_1: CR6.1(A) CR7.2(K) R61.1 R104.2 TP49.1 U9.5(VO)
NetCR8_2: CR8.2(K) CR9.1(A) D8.2(C) D12.2(C) R58.1 R65.1 TP52.1 U10.6(OUT) U10.7(OUT)
NetD1_2: D1.2(K) D5.2(K)
NetD2_2: D2.2(C) D10.2(C) D11.2(C) Q3.1(GATE) Q4.1(GATE) R53.1 R54.1 R62.2 R103.2 R105.2
NetD4_1: D4.1(A) P3.1 U20.6
NetD4_2: D4.2(K) D6.2(K)
NetD6_1: D6.1(A) P3.2 U20.7
NetD8_1: D8.1(A) D12.1(A) R103.1 R105.1
NetDS2_2: DS2.2(K) R68.1
NetDS3_2: DS3.2(K) R70.1
NetDS4_1: DS4.1(A) R75.1 TP35.1 U14.4(Y)
NetDS4_2: DS4.2(K) R80.1
NetDS5_1: DS5.1(A) R77.1 TP37.1 U15.4(Y)
NetDS5_2: DS5.2(K) R81.1
NetDS6_1: DS6.1(A) R60.1 TP48.1 U8.4(Y)
NetDS6_2: DS6.2(K) R82.1
NetDS7_2: DS7.2(K) R96.1
NetDS8_2: DS8.2(K) R98.1
NetDS9_2: DS9.2(K) R99.1
NetEC2_57: EC2.57 Q5.1(B) ; port Display-TX
NetEC2_59: EC2.59 OK1.1(VO) R134.2 R136.1 ; port Display-RX
NetEC2_64: EC2.64 Rj1.2
NetEC2_65: EC2.65 Rj5.1
NetEC2_66: EC2.66 Rj2.2
NetEC2_67: EC2.67 Rj6.1
NetEC2_68: EC2.68 Rj3.2
NetEC2_69: EC2.69 Rj7.1
NetEC2_70: EC2.70 Rj4.2
NetEC2_71: EC2.71 Rj8.1
NetEC2_94: EC2.94 Rj9.2
NetEC2_95: EC2.95 Rj10.1
NetEC2_96: EC2.96 Rj11.2
NetEC2_100: EC2.100 Rj12.2
NetF3_1: F3.1 U7.8(OUT) U7.9(OUT) U7.10(OUT)
NetF3_2: F3.2 P2.1 P2.2
NetFB1_2: FB1.2 R59.1 R133.1
NetFB3_2: FB3.2 R67.2
NetFB4_2: FB4.2 R74.1
NetFB5_2: FB5.2 R76.1
NetFB6_1: FB6.1 R47.2 R49.1
NetFB7_1: FB7.1 R48.2 R50.1
NetFB8_1: FB8.1 R67.1 R69.2
NetFB9_1: FB9.1 P3.4 R85.1
NetJ6_2: J6.2 U7.1(IN) U7.2(IN) U7.3(IN)
NetP3_3: P3.3 R83.2 R84.2
NetQ1_3: Q1.3(SHDN) R31.2
NetQ1_7: Q1.7(VOUT+) R15.1 R21.2 TP13.1
NetQ2_3: Q2.3(SHDN) R32.2
NetQ2_7: Q2.7(VOUT+) R16.1 R23.2 TP15.1
NetQ5_3: Q5.3(C) R135.2 Trans1.1(ANODE)
NetR17_1: R17.1 R18.2
NetR18_1: R18.1 R26.1 R29.1
NetR19_1: R19.1 R20.2
NetR20_1: R20.1 R28.1 R30.1
NetR29_2: R29.2 R36.1 R43.1 R93.2
NetR30_2: R30.2 R38.1 R44.1 R92.2
NetR35_1: R35.1 R36.2
NetR37_1: R37.1 R38.2
NetR55_1: R55.1 R56.2 R123.1 TP46.1
NetR55_2: R55.2 U7.11(OUT)
NetR58_2: R58.2 R62.1 R65.2
NetR59_2: R59.2 U8.2(A)
NetR60_2: R60.2 R132.1 U9.1(ANODE)
NetR61_2: R61.2 U10.2(IN)
NetR64_2: R64.2 U8.1(NC)
NetR66_2: R66.2 U9.2(NC)
NetR71_2: R71.2 U10.3(NC)
NetR74_2: R74.2 U14.2(A)
NetR75_2: R75.2 U17.1(A)
NetR76_2: R76.2 U15.2(A)
NetR77_2: R77.2 U16.1(A)
NetR78_2: R78.2 U14.1(NC)
NetR79_2: R79.2 U15.1(NC)
NetR106_2: R106.2 R110.1
NetR107_2: R107.2 R111.1
NetR108_2: R108.2 R109.2 R112.1 R113.1
NetR121_2: R121.2 R122.1
NetR124_1: R124.1 TP58.1 U18.6(VOUTN)
NetR127_1: R127.1 TP55.1 U18.7(VOUTP)
NetR130_1: R130.1 R131.1 S1.3
NetU17_4: U17.4(C) U20.3

Not connected (* = marked no-connect by the designer): EC2 2 3 4 5 6 7 8 11 12 13 14 15 17 19 20 21 22 25 26 27 28 29 30 31 32 33 35 39 41 43 44 45 46 47 48 49 50 51 52 53 55 58 61 62 63 76 77 78 79 80 81 82 84 85 87 88 89 90 91 93 113 115 116 117 118 119 120 G1(121); J4 M1 M2; J5 M1 M2; OK1 3(Open); U3 4(trim) 6(on/off); U4 1 2 3 4 5 6; U5 4(trim) 6(on/off); U6 4(trim) 6(on/off); U12 4(trim)* 6(on/off)*; U20 8

### Notes on the sheet
- 4kW 600V Converter
- (near TP26) Processor Power Supply
- To processor
- DC Power supplies
- Inrush current limiter driver
- footprint of D1 and D5 are different
- AFB0412VHA-A 12VDC Fan Part number
- AM3G-2412S-NZ DC Power supply
- Fan driving
- (near TP36) From processor
- NTCLE413 NTC thermistor
- با 6 پیچ ارت از گراندها جدا شوند، و جاپیچها ارت شوند
- (near U4) SiC MOSFET and Diode (connecting to heatsink)
- From processor
- It is suggested to placed in downstream of the fan hot air flow
- Fuse part number: KLKD008.T 8A fuse
- Input capacitor bank of the Buck converter
- 74*45 and H is 30mm
- Heat sink V5583G
- (near L3) این سلف دارای ابعاد نشان داده شده و به شکل زیر است
- For this diode and mosfet a heat sink should be connected.
- (near F3) 0031.8002 16A fuse
- Fast Driving circuit
- (near D12) This IC has pad underneath
- (near TP47) Mosfet of Buck driving command
- Optocoupler
- care should be taken
- (near R63) 0603 Resistor
- Note: The part number and the scheme are not the same.
- (near R65) Axial 0.3 inches resistor
- MB is Mosfet of Buck
- Connectors are added to the library
- DC-DC Buck converter 66kHz
- (near C65) This IC is isolator but the two grounds are connected, is it just to break round loop or it is a mistake?
- r129 footprint is not correct
- (near C76) footprint for HFBR-1522Z is not correct
- (near J4) Full bridge connection
- (near J5) Auxiliary connector
- (in symbol AM3G-2412S-NZ) DC
- (in symbol Res Thermal) t°

### Library data of the parts
C1 C2 C9 C10 C29 C33 C41 C42 C45 C78 = CapSMD
C3-C8 C11-C14 C71 = Cap ceramic: None polar capacitor; Volte: 50v
  C3 C4 C6 C8 C13 C14 C71: Value: 100nF
  C5 C7 C11 C12: Value: 100pF
C15 C43 C44 C52 C77 = Ceramic disk capacitor: MF: AVX; MP: LD052C153JAB2A; Price: None; SnapEDA_Link: https://www.snapeda.com/parts/LD052C153JAB2A/AVX/view-part/2034833/?ref=snap; Package: 0805 AVX; Availability: Warning; Value: *
C16-C28 C34-C40 C47 C48 C53-C58 C60-C64 C66-C69 = Cap Pol2: Polarized Capacitor (Axial); Published: 8-Jun-2000; LatestRevisionDate: 17-Jul-2002; LatestRevisionNote: Re-released for DXP Platform.; PackageReference: POLAR0.8; Publisher: Altium Limited
C30 = Cap ceramic: None polar capacitor; Value: 100nF
C31 C32 C46 C49-C51 C59 C65 C70 C72-C75 = Cap: Capacitor; Published: 8-Jun-2000; LatestRevisionDate: 17-Jul-2002; LatestRevisionNote: Re-released for DXP Platform.; PackageReference: RAD-0.3; Publisher: Altium Limited
C76 = CMP-1037-04917-1: CAP 4.7uF 25V ±5% 1206 (3216 Metric) Thickness 1.9mm SMD; Tolerance: Â±5%; Case-Metric: 3216; Case-EIA: 1206; Max Thickness: 1.9 mm; Rated Voltage: 25 V; Value: 4.7uF; Technology: SMT
CR4-CR9 = DiodeSMD4.5mm
D1 D4 = D Zener: Zener Diode; Published: 8-Jun-2000; LatestRevisionDate: 17-Jul-2002; LatestRevisionNote: Re-released for DXP Platform.; PackageReference: DIODE-0.7; Publisher: Altium Limited; PackageDescription: Diode, Thru-Hole; 2 Leads; 0.7 in Pin Spacing
D2 D7 D8 D10-D12 = 1N4007: Diode Standard 1000V 1A Through Hole DO-204AL _DO-41_; MF: ON Semiconductor; Package: DO-41 Good-Ark; Value: *; Price: None; MP: 1N4007; Availability: Unavailable; SnapEDA_Link: https://www.snapeda.com/parts/1N4007/ON%20Semiconductor/view-part/2816213/?ref=snap
D3 D9 = CMP-240925-000069-1: E SERIES, 20 AMP, 1200V G4 SCHOT; RoHS Compliant: Yes
D5 D6 = D Schottky: Schottky Diode; Published: 8-Jun-2000; LatestRevisionDate: 17-Jul-2002; LatestRevisionNote: Re-released for DXP Platform.; PackageReference: SMB; Publisher: Altium Limited; PackageDescription: DO-214-AA/SMB; 2 C-Bend Leads; Body 5.3 x 3.6 mm, inc. leads (LxW); Code_JEDEC: DO-214-AA
DS3-DS6 = LED: Blue SURFACE MOUNT LED LAMP, -40 to +85 ,0805 SIZE; PART NUMBER: QTLP630C-7; MANUFACTURE: Fairchild Semiconductor
EC2 = HSEC8-160-01-X-RA-BL: 0.8MM HIGH SPEED ASSEMBLY.; Package: None; Price: None; Value: *; MP: HSEC8-160-01-X-RA-BL; Availability: Unavailable
F2 F3 = Fuse 1: Fuse; Published: 8-Jun-2000; LatestRevisionDate: 17-Jul-2002; LatestRevisionNote: Re-released for DXP Platform.; PackageReference: PIN-W2/E2.8; Publisher: Altium Limited; PackageDescription: Thru-Hole; 2 Leads
FB1-FB10 = FERRITE CHIP
J3 J6 = 691101710002: WR-TBL Series 101 Horizontal Entry Modular, THT, pitch 5mm, 2p; Manufacturer: Wurth Elektronik; Modularity: Yes; Rated Current: 16A; Working Voltage: 250V; ComponentLink1Description: Website Link; ComponentLink1URL: https://www.we-online.com/redexpert/article/691101710002?ad; ComponentLink2Description: Datasheet Link; ComponentLink2URL: https://www.we-online.com/redexpert/spec/691101710002?ad; Manufacturer Part Number: 691101710002; Category: Terminal Blocks; Match Code: WR-TBL; Mount: Through Hole; Operating Temperature Max: 105°C; Operating Temperature Min: -40°C; Packaging: Box; Application: Pressure Clamp; Number of Pins: 2; Number of Rows: 1; Orientation: Horizontal; Pitch: 5mm
J4 = 61802525123: WR-DSUB Female PCB Connector, Straight, 25p; Manufacturer: Wurth Elektronik; Contact Resistance: 300mΩ; Rated Current: 3A; Working Voltage: 125VAC; Withstanding Voltage: 1000VAC; ComponentLink1Description: Website Link; ComponentLink1URL: https://www.we-online.com/redexpert/article/61802525123?ad; ComponentLink2Description: Datasheet Link; ComponentLink2URL: https://www.we-online.com/redexpert/spec/61802525123?ad; Manufacturer Part Number: 61802525123; Category: Input/Output Connectors; Match Code: WR-DSUB; Mount: Through Hole; Operating Temperature Max: 105°C; Operating Temperature Min: -55°C; Packaging: Tube; Gender: Female; Number of Pins: 25; Orientation: Straight
J5 = 61801525123: WR-DSUB Female PCB Connector, Straight, 15p; Manufacturer: Wurth Elektronik; Contact Resistance: 300mΩ; Rated Current: 3A; Working Voltage: 125VAC; Withstanding Voltage: 1000VAC; ComponentLink1Description: Website Link; ComponentLink1URL: https://www.we-online.com/redexpert/article/61801525123?ad; ComponentLink2Description: Datasheet Link; ComponentLink2URL: https://www.we-online.com/redexpert/spec/61801525123?ad; Manufacturer Part Number: 61801525123; Category: Input/Output Connectors; Match Code: WR-DSUB; Mount: Through Hole; Operating Temperature Max: 105°C; Operating Temperature Min: -55°C; Packaging: Tube; Gender: Female; Number of Pins: 15; Orientation: Straight
K1 = CMP-03395-000232-1: RELAY GEN PURPOSE SPST 16A 12V; Coil Current: 33.3mA; Application(s): GENERAL PURPOSE; Power Rating: 400mW; Approvals: CSA; Contact Voltage Rating (AC): 250V; Coil Resistance: 360R; Operate Time: 8ms; Coil Type: Non-Latching; Release Time: 6ms; Voltage Rating (AC): 400V; Coil Voltage (DC): 12V; Series: RT1; Mount: Through Hole; RoHS Compliant: Yes; Package Quantity: 20; Coil Power: 400mW; Case/Package: DIP; Length: 29mm; Min Operating Temperature: -40°C; Weight: 0.494oz; Current Rating: 16A; Width: 12.7mm; Relay Type: General Purpose; Termination: Plug; Height: 15.7mm; Contact Current Rating: 16A; Throw Configuration: SPST; Number of Pins: 8; Max Voltage Rating (AC): 400V; Radiation Hardening: No; Power Consumption: 400mW; Depth: 12.7mm; Packaging: Carton; Contact Material: Silver; Max Operating Temperature: 85°C
L3 = Inductor: Code_IEC: 1005; Published: 8-Jun-2000; LatestRevisionDate: 29-May-2009; LatestRevisionNote: IPC-7351 Footprint Added.; PackageReference: 0402-A; Publisher: Altium Limited; PackageDescription: Chip Inductor; Code_JEITA: 0402
OK1 = HFBR-25x3Z: The Versatile Fiber Optic Connection, 40 kBd, -40 to 85 degC, 4-Pin, RoHS, Rail/Tube
P1 P2 = CMP-1502-02410-1: Serie 3114 - 7.62mm Close Vertical PCB Header WR-TBL, 4 pin; Manufacturer: Wurth Elektronik; Gender: Male; Pin Number: 4; Packaging: Box; Datasheet URL: http://katalog.we-online.de/em/datasheet/6913114001xx.pdf; Operating Temperature: -40to105degC; Package Reference: 691311400104; Mounting Technology: THT; Publisher: WurthElektronik; Pitch: 7.62mm; Manufacturer URL: http://www.we-online.de; Part Number: 691311400104
P3 P4 = CMP-2000-05548-1: Male Header, Pitch 2.54 mm, 1 x 4 Position, Height 12.8 mm, Tail Length 3.5 mm, -55 to 105 degC, RoHS, Bulk; Manufacturer: TE Connectivity; Pitch: 0.100"(2.54mm); Connector Type: Header,Shrouded; Other Names: 280371-2-ND / A106401; Number of Positions Loaded: All; Dynamic Catalog: AMPMODUModIISeries; Number of Positions: 4; 3D Model: 280371-2.pdf; Termination: Solder; Package Description: Male Header, Pitch 2.54 mm, 1 x 4 Position, Height 12.8 mm, Tail Length 3.5 mm; Datasheet Version: Rev. M1, 08/2016; Contact Mating Length: 0.260"(6.60mm); Datasheet URL: http://www.te.com/commerce/DocumentDelivery/DDEController?Action=showdoc&DocId=Customer+Drawing%7F280370%7FM1%7Fpdf%7FEnglish%7FENG_CD_280370_M1.pdf%7F280371-2; Mounting Technology: ThroughHole; Standard Package: 1,000; Contact Finish Thickness: 15µin(0.38µm); Contact Finish: Gold; Contact Type: MalePin; Packaging: Bulk; Mounting Type: ThroughHole; Number of Rows: 1; Family: RectangularConnectors-Headers,MalePins; Manufacturer URL: http://www.te.com/; Color: Black; RoHS Information: 280371-2StatementofCompliance; Package Reference: 280371-2; Category: Connectors,Interconnects; Series: AMPMODUModII
Q1 Q2 = CMP-18360-000002-1: IC OPAMP ISOLATION 100KHZ 8SO; Turn-On Delay Time: 6500ns; Number of Circuits: 1; Forward Current: 230mA; Max Supply Voltage: 5.5V; Min Supply Voltage: 4.5V; Operating Supply Voltage: 5V; Operating Supply Current: 10.5mA; Input Offset Voltage (Vos): 300uV; Input Bias Current: 1.5nA; Nominal Supply Current: 15mA; Isolation Voltage: 5kV; Output Current per Channel: 30mA; -3db Bandwidth: 100kHz; Radiation Hardening: No; Case/Package: SOIC; Min Operating Temperature: -40°C; Number of Pins: 8; Package Quantity: 1000; Bandwidth: 100kHz; Propagation Delay: 6500ns; Packaging: Tape and Reel; Number of Channels: 1; Max Operating Temperature: 105°C; Mount: Surface Mount
Q3 Q4 = CMP-1164-00191-1: N-Channel CoolMOS Power-Transistor, 600 V VDS, 31 A ID, -55 to 150 degC, PG-TO247-3-44, Tube, Green; Manufacturer: Infineon; PartNumber: IPW60R099CP; RDS (on) (max): 99Â mOhm; VGS(th) (max): 3.5Â V; Green: TRUE; Rth: 0.5Â K/W; VGS(th) (min): 2.5Â V; QG: 60Â nC; Ptot (max): 255Â W; Polarity: N; VDS (max): 600Â V; IDpuls (max): 93Â A; ID (max): 31Â A; RthJA (max): 62Â K/W; Packing: Tube; PackageVersion: Rev. 03; PackageDescription: 3-Pin Plastic (Green) Transistor Single Outline Package, 15.94 x 20.95 mm Body, 5.44 mm Pitch; ComponentLink2Description: Datasheet; ComponentLink1URL: http://www.infineon.com/; ComponentLink3Description: Package Specification; PackageReference: PG-TO247-3-44; Halogen-free: available; DatasheetVersion: Rev. 2.1; RthJC (max): 0.5Â K/W; ComponentLink1Description: Manufacturer URL; Mounting Technology: Through Hole; Technology: CoolMOS CP; ComponentLink3URL: http://www.infineon.com/cms/packages/Leaded_and_through-hole/P-PG-TO247/P-PG-TO247-3-44.html?__locale=en; ComponentLink2URL: http://www.infineon.com/dgdl/IPW60R099CP_rev2%5B1%5D.1_PCN.pdf?folderId=db3a304412b407950112b408e8c90004&fileId=db3a304412b407950112b42ca4c24745
Q5 = CMP-0630-00196-1: Digital Transistor (BRT), R1=4.7 kOhm, R2=47 kOhm, NPN Transistor, 3-Pin SC-75, Pb-Free, Tape and Reel; Manufacturer: On Semiconductor; hFE Min: 80; V(BR)CEO Min (V): 50; IC Continuous (A): 0.1; ComponentLink1URL: http://www.onsemi.com/; ComponentLink2Description: Datasheet; DatasheetVersion: Rev. 4; Packing: Tape and Reel; ComponentLink1Description: Manufacturer URL; PackageDescription: 3-Pin Small Outline Transistor, Body 1.6 x 0.8 mm, Pitch 0.5 mm; Mounting Technology: Surface Mount; PartNumber: DTC143ZET1G; Polarity: NPN; PackageReference: SC-75-3-463-01; RoHS: TRUE; PackageVersion: Rev. F, 07/2005; ComponentLink2URL: http://www.onsemi.cn/pub_link/Collateral/DTC143Z-D.PDF; ComponentLink3Description: Package Specification; R1/R2 Typ: 0.1; ComponentLink3URL: http://www.onsemi.com/pub_link/Collateral/463-01.PDF
R1 R2 R26 R28 R43 R44 R53 R54 R60 R67 R69 R70 R75 R77 R80-R82 R86 R87 R92 R93 R96 R98-R101 R126 R132 R133 = ResSMD
R31 R32 R55-R57 R59 R63 R64 R66 R71-R74 R76 R78 R79 R115-R119 R130 R131 = Res3: Resistor; Published: 8-Jun-2000; LatestRevisionDate: 29-May-2009; LatestRevisionNote: IPC-7351 Footprint Added.; PackageReference: J1-0603; Publisher: Altium Limited; PackageDescription: Chip Resistor
R52 R102 R103 R105-R114 = Res Semi: Semiconductor Resistor; Published: 8-Jun-2000; LatestRevisionDate: 17-Jul-2002; LatestRevisionNote: Re-released for DXP Platform.; PackageReference: AXIAL-0.5; Publisher: Altium Limited; PackageDescription: Axial Device, Thru-Hole; 2 Leads; 0.5 in Pin Spacing
R58 R61 R62 R65 R104 R129 = Res1: Resistor; Published: 8-Jun-2000; LatestRevisionDate: 17-Jul-2002; LatestRevisionNote: Re-released for DXP Platform.; PackageReference: AXIAL-0.3; Publisher: Altium Limited; PackageDescription: Axial Device, Thru-Hole; 2 Leads; 0.3 in Pin Spacing
  R104: Value: 47k
R68 = Res: resistor 1/4 wat; Value: 1K
R120 = Res Varistor: Varistor (Voltage-Sensitive Resistor); Published: 24-Mar-1999; LatestRevisionDate: 29-May-2009; LatestRevisionNote: IPC-7351 Footprint Added.; PackageVersion: Mar-2003; PackageReference: 6-0805; Publisher: Altium Limited; PackageDescription: Chip Resistor 0805 Case Size; Code_IPC: RESC2012
R121-R125 R127 R128 = CMP-1014-00542-3: RES Thick Film, 2kΩ, 1%, 0.25W, 100ppm/°C, 1206; Max Power Dissipation: 250mW; Voltage Rating: 200V; Resistance: 2kR; Package Quantity: 10; Height: 0.55mm; Tolerance: 1%; Number of Terminations: 2; Mount: Surface Mount; Width: 1.6mm; Length: 3.2mm; Features: Automotive AEC-Q200; Contact Plating: Tin; Number of Pins: 2; Weight: 0.000353oz; Max Operating Temperature: 155°C; Min Operating Temperature: -55°C; Termination: SMD/SMT; Temperature Coefficient: 100ppm/°C; Case Code (Imperial): 1206; Depth: 1.6mm; Military Standard: Not; Case Code (Metric): 3216; Composition: Thick Film; Power Rating: 250mW; Case/Package: 1206; Radiation Hardening: No; Packaging: Tape and Reel
R134-R136 = CMP-2000-04330-1: Manufacturer: Yageo; Part Number: RC0603JR-13820RL
Rj1-Rj12 = ERJ-3GEY0R00V: RES, 0, 5%, 0.1 W, 0603; Manufacturer: Panasonic; CompType: Resistor; Value: 0; Value_Code: 0000; Tolerance_%: 5; Power_W: 0.1; Value2: 0.1W; VDC_V: 50; TempCo: 600 ppm/C; EIA_Code: E24; U/M: EA; AEC Category: Q200; SizeArea_mm2: 1.28; SizeX_mm: 1.6; SizeY_mm: 0.8; SizeZ_mm: 1; SymbolVersion: 2009-05-29; PartNumber: ERJ-3GEY0R00V; PackageReference: 0603; RoHS: Y; Res_ohm: 0; Value1: 5%; MountType: SMT; Technology: Thick Film; Published: 2008-06-26; Publisher: Texas Instruments; LatestRevisionDate: 2016-06-29; ComponentLink1Description: Datasheet link; ComponentLink1URL: http://www.panasonic.com/industrial/components/pdf/AOA0000CE1.pdf; Supplier 1: Digi-Key; Supplier Part Number 1: P0.0GCT-ND; Supplier 2: Mouser; Supplier Part Number 2: 667-ERJ-3GEY0R00V; Supplier 3: Farnell; Supplier Part Number 3: 2059527; AEC Qualified: ?
RT1 = Res Thermal: Thermistor; Published: 24-Mar-1999; LatestRevisionDate: 29-May-2009; LatestRevisionNote: IPC-7351 Footprint Added.; PackageVersion: Mar-2003; PackageReference: 6-0805; Publisher: Altium Limited; PackageDescription: Chip Resistor 0805 Case Size; Code_IPC: RESC2012
S1 = SW-SPDT: SPDT Subminiature Toggle Switch, Right Angle Mounting, Vertical Actuation; Published: 24-Mar-1999; LatestRevisionDate: 17-Dec-2003; LatestRevisionNote: Schematic revised, PCB Footprint replaced.; DatasheetVersion: 05-Dec-2000; PackageReference: TL36WW15050; Publisher: Altium Limited; PackageDescription: Switch; 4 Leads; ComponentLink1Description: Manufacturer Link; ComponentLink1URL: http://www.apem.com
TP1-TP5 TP7-TP23 TP25-TP59 = Con1 pin-Small
Trans1 = HFBR-1522Z: The Versatile Fiber Optic Connection, 5 V, -40 to 85 degC, 6-Pin THD, RoHS, Tube; Manufacturer: Avago; Current - DC Forward (If) (Max): 80mA; Online Catalog: HFBR-15xxZ; Other Names: 516-2044HFBR1522Z; Voltage - Forward (Vf) (Typ): 2.02V; Capacitance: 86pF; Wavelength: 660nm; Voltage - DC Reverse (Vr) (Max): 5V; Connector Type: VersatileLink; PCN Design/Specification: Mold/Design29/Jul/2011Lead-FrameUpdates09/Jun/2015Lead-FrameUpdate09/Jun/2015; Series: -; Datasheet URL: http://www.avagotech.com/docs/AV02-1501EN; Category: Optoelectronics; Standard Package: 200; Datasheet Version: 09/2014; Spectral Bandwidth: -; Package Reference: HFBR-15X2Z; Package Description: 6-Pin Through Hole Device, Body 18.8 x 12.19 mm, Pitch 2.54 mm; Mounting Technology: ThroughHole; Manufacturer URL: http://www.avagotech.com/; Family: FiberOptics-Transmitters-Discrete
U1 U2 = CMP-0272-01600-3: Ultra-Low Noise Precision Operational Amplifier, 8 to 44 V, -40 to 85 degC, 8-pin DIP (P8), Green (RoHS & no Sb/Br); Manufacturer: Texas Instruments; Total Supply Voltage(Max)(+5V is 5, +/-5V is 10): 44; Total Supply Voltage(Min)(+5V is 5, +/-5V is 10): 8; CMRR(Min)(dB): 100; Number of Channels: 1; Slew Rate(Typ)(V/us): 1.9; Packing: TUBE; Iq per channel(Max)(mA): 5.7; Sub Family: High Supply Voltage Amplifier (>=30V), Low Noise Amp (<=10nV/rtHz), Low Offset Voltage Amplifier (<=500uV), Precision Amplifier; Vio (25C)(Max)(mV): 0.1; IIB(Max)(pA): 80000; Offset Drift(Typ)(uV/C): 0.4; Rating: Catalog; PackageReference: P0008A; ComponentLink2Description: Datasheet; ComponentLink3URL: http://www.ti.com/litv/pdf/mpdi001b; PackageVersion: 4040082/E, 04/2010; ComponentLink3Description: Package Specification; ComponentLink1URL: http://www.ti.com/; Eco-Plan: Green (RoHS & no Sb/Br); Mounting Technology: Through Hole; ComponentLink1Description: Manufacturer URL; PackageDescription: 8-Pin Plastic In-Line, Body 9.59 x 6.35 mm, Pitch 2.54 mm; PartNumber: OPA27GP; Code_JEDEC: MS-001; ComponentLink2URL: http://www.ti.com/lit/ds/symlink/opa27.pdf; DatasheetVersion: SBOS135C; GBW(Typ)(MHz): 8
U3 U5 U6 U12 = MINMAX-MJWI20
U7 = CAS 15-NP: Current Transducer, 5 V, -40 to 85 degC, 10-Pin THD, RoHS, Tray; Manufacturer: LEM; PartNumber: LTSR 15-NP; IP: 250 At; IPN: 15 At; G: 41.6 mV/A; VC: 5 V; CL: 500 pF Max.; Mounting Technology: Through Hole; ComponentLink1URL: http://www.lem.com/; ComponentLink3Description: Package Specification; DatasheetVersion: Feb-11; Packing: Tray; PackageDescription: 10-Pin THD, Body 22.2 x 9.3 mm, Height 24 mm; ComponentLink1Description: Manufacturer URL; ComponentLink3URL: http://www.lem.com/docs/products/ltsr%2015-np.pdf; Operating Temperature Range: -40 to 85 degC; ComponentLink2Description: Datasheet; ComponentLink2URL: http://www.lem.com/docs/products/ltsr%2015-np.pdf
U8 U14 U15 = CMP-0859-00388-5: IC BUF NON-INVERT 5.5V SC70-5; Number of Elements: 1; Polarity: Non-Inverting; Low Level Output Current: 32mA; Propagation Delay: 11ns; Logic Function: Schmitt Trigger; Min Supply Voltage: 1.65V; Quiescent Current: 1.5uA; High Level Output Current: -32mA; Packaging: Tape and Reel; Number of Gates: 1; Number of Output Lines: 1; Package Quantity: 1; Radiation Hardening: No; Max Supply Voltage: 5.5V; Contact Plating: Gold; Number of Outputs: 1; Number of Channels: 1; Termination: SMD/SMT; REACH SVHC: No SVHC; Number of Inputs: 1; Turn-On Delay Time: 11ns; Min Operating Temperature: -40°C; Number of Bits: 1; Number of Input Lines: 1; Number of Bits per Element: 1; Case/Package: SC; Number of Pins: 5; Mount: Surface Mount; Lead Free: Lead Free; Max Operating Temperature: 125°C
U9 = CMP-0512-00083-1: Led Emulator Input, 4.0 A Isolated Gate Drivers, 5 to 30 V Driver Supply, 5 kVRMS Isolation Rating, -40 to 125 degC, 6-pin SOP; Manufacturer: Silicon Labs; Overlap Protection & Dead Time Control: FALSE; Max. Prop. Delay (ns): 60; Sub-Family: ISOdrivers; Isolation Rating (Input-Output, kVrms): 5; UVLO Voltage: 8 V; 10kV surge: TRUE; Driver Supply: 5 to 30 V; ComponentLink2URL: http://www.silabs.com/Support%20Documents/TechnicalDocs/Si826x.pdf; PackageDescription: 6-Pin SDIP, Body 4.58 x 7.5 mm, Pitch 1.27 mm; ComponentLink3Description: Package Specification; Mounting Technology: Surface Mount; DatasheetVersion: Rev. 0.9; PartNumber: Si8261BBD-C-IS; ComponentLink2Description: Datasheet; ComponentLink1URL: http://www.silabs.com/; PackageReference: SDIP6; ComponentLink1Description: Manufacturer URL; ComponentLink3URL: http://www.silabs.com/Support%20Documents/TechnicalDocs/Si826x.pdf
U10 = CMP-1550-00001-1: 9-Ampere Low-Side Ultrafast MOSFET Driver, 4.5 to 35 V, 200 KOhm, -40 to 125 degC, 8-Pin SOIC (SI), RoHS, Tube; Number of Configurations: 1; VCC Max: 35 V; VCC Min: 4.5 V; ComponentLink1Description: Manufacturer URL; Temperature Max: 125 degC; Packing: Tube; RoHS: TRUE; REN Typ: 200 kOhm; ComponentLink2URL: http://www.ixysic.com/home/pdfs.nsf/www/IXD_609.pdf/$file/IXD_609.pdf; ComponentLink3Description: Package Specification; Number of Outputs: 1; ComponentLink1URL: http://www.ixys.com/; ComponentLink2Description: Datasheet; PackageDescription: 8-Pin Small Outline Integrated Circuit Package, Body 4.928 x 3.937 mm, Pitch 1.27 mm; Mounting Technology: Surface Mount; PartNumber: IXDN609SI; Temperature Min: -40 degC; ComponentLink3URL: http://www.ixysic.com/home/pdfs.nsf/www/IXD_609.pdf/$file/IXD_609.pdf
U11 = LT1764AEQ-3.3: 3 A, Fast Transient Response, Low Noise, LDO Regulator, 2.7 to 20 V Vin, 3.3 V Vout, 5-pin DPAK (Q-5), -40 to 125 degC; Manufacturer: Linear Technology; Discrete Pass Element: no; Dropout Voltage(V): 0.34; Iout(mA): 3000; Isupply(mA): 1; Noise(uV): 40; Output Voltage: 3.3 V; PSRR(dB): 63; Shutdown Current(uA): 0.01; Vin Max(V): 20; Vin Min(V): 2.7; DatasheetVersion: Rev. B; PackageVersion: Rev. F, 09/2011; PackageReference: Q-5; PackageDescription: 5-Pin Plastic DD Pak, Body 10.2235 x 8.89 mm, Pitch 1.702 mm; Supplier 1: Digi-Key; Supplier Part Number 1: LT1764AEQ-3.3-ND; Supplier 2: Newark; Supplier Part Number 2: 57M6104; Number of Outputs: 1; RoHS: FALSE; Mounting Technology: Surface Mount; PartNumber: LT1764AEQ-3.3; ComponentLink1Description: Manufacturer URL; ComponentLink1URL: http://www.linear.com/; ComponentLink2Description: Datasheet; ComponentLink2URL: http://cds.linear.com/docs/en/datasheet/1764afb.pdf; ComponentLink3Description: Package Specification; ComponentLink3URL: http://cds.linear.com/docs/en/packaging/Q%20DD5%2005-08-1461%20Rev%20F.pdf
U16 U17 = PC817
U18 = CMP-04893-000001-1: IC ISOLATION 8SOIC; Manufacturer: Texas Instruments; Input Offset Voltage: -1.1mV; Standoff Height: 0.36mm; Max Junction Temp: +150°C; Number Of Channels: 1; Input Bias Current: 0.0035uA; Max Supply Voltage: 5.5V; Min Supply Voltage: 3V; Nominal Supply Current: 1.3-7100uA; Temperature Range Low: -55°C; Device Class L3: unset; RoHS: TRUE; Digikey Description: IC ISOLATION 8SOIC; Lead Free: Yes; Device Class L1: Integrated Circuits (ICs); Manufacturer Part Number: AMC1311BDWV; ComponentLink2URL: http://www.ti.com/lit/ds/symlink/amc1311.pdf; Height: 2.8mm; Octopart: https://octopart.com/amc1311bdwv-texas+instruments-88030782; Device Class L2: Linear ICs; Ambient Temperature Range Low: -40°C; Category: IC; Ipc Land Pattern Name: SOIC127P1150X280-8; ComponentLink2Description: Datasheet; Temperature: -55°C to +125°C; Ambient Temperature Range High: +125°C; Automotive: No; Mouser Description: Isolated Amplifier High-Impedance 2V Input Reinforced 3V to 5.5V 8-Pin SOIC Tube; Temperature Range High: +125°C; Package: DWV0008A
U19 = CMP-0272-00853-3: Precision, 20 MHz, 0.9 pA Ib, RRIO, CMOS Operational Amplifier, 1.8 to 5.5 V, -40 to 125 degC, 5-pin SOT23 (DBV5), Green (RoHS & no Sb/Br); PartNumber: OPA320AIDBVR; Manufacturer: Texas Instruments; Vio (25C)(Max)(mV): 0.15; Number of Channels: 2; Slew Rate(Typ)(V/us): 10; CMRR(Min)(dB): 100; Sub Family: High Output Current Amplifier (>=50mA), Low Input Bias Current Amp (<=10pA), Low Noise Amp (<=10nV/rtHz), Low Offset Voltage Amplifier (<=500uV), Low Supply Voltage Amplifier (<=2.7V), Precision Amplifier; Total Supply Voltage(Min)(+5V is 5, +/-5V is 10): 1.8; Iq per channel(Max)(mA): 1.75; Vn at 1kHz(Typ)(nV/rtHz): 8.5; Offset Drift(Typ)(uV/C): 1.5; IIB(Max)(pA): 0.9; Total Supply Voltage(Max)(+5V is 5, +/-5V is 10): 5.5; PackageVersion: 4073253-4/K, 03/2006; Code_JEDEC: MO-178; ComponentLink2Description: Datasheet; PackageDescription: 5-Pin Plastic Small Outline, Body 1.6 x 2.9 mm, Pitch 0.95 mm; Eco-Plan: Green (RoHS & no Sb/Br); ComponentLink1Description: Manufacturer URL; Mounting Technology: Surface Mount; ComponentLink3Description: Package Specification; ComponentLink3URL: http://www.ti.com/litv/pdf/mpds018i; PackageReference: DBV0005A; ComponentLink2URL: http://www.ti.com/general/docs/lit/getliterature.tsp?genericPartNumber=OPA320&fileType=pdf; DatasheetVersion: SBOS513D; ComponentLink1URL: http://www.ti.com/